# EAGLE design HATv1 (EAGLE 9.1.3)

## Sheet 1 of 4: Power Components
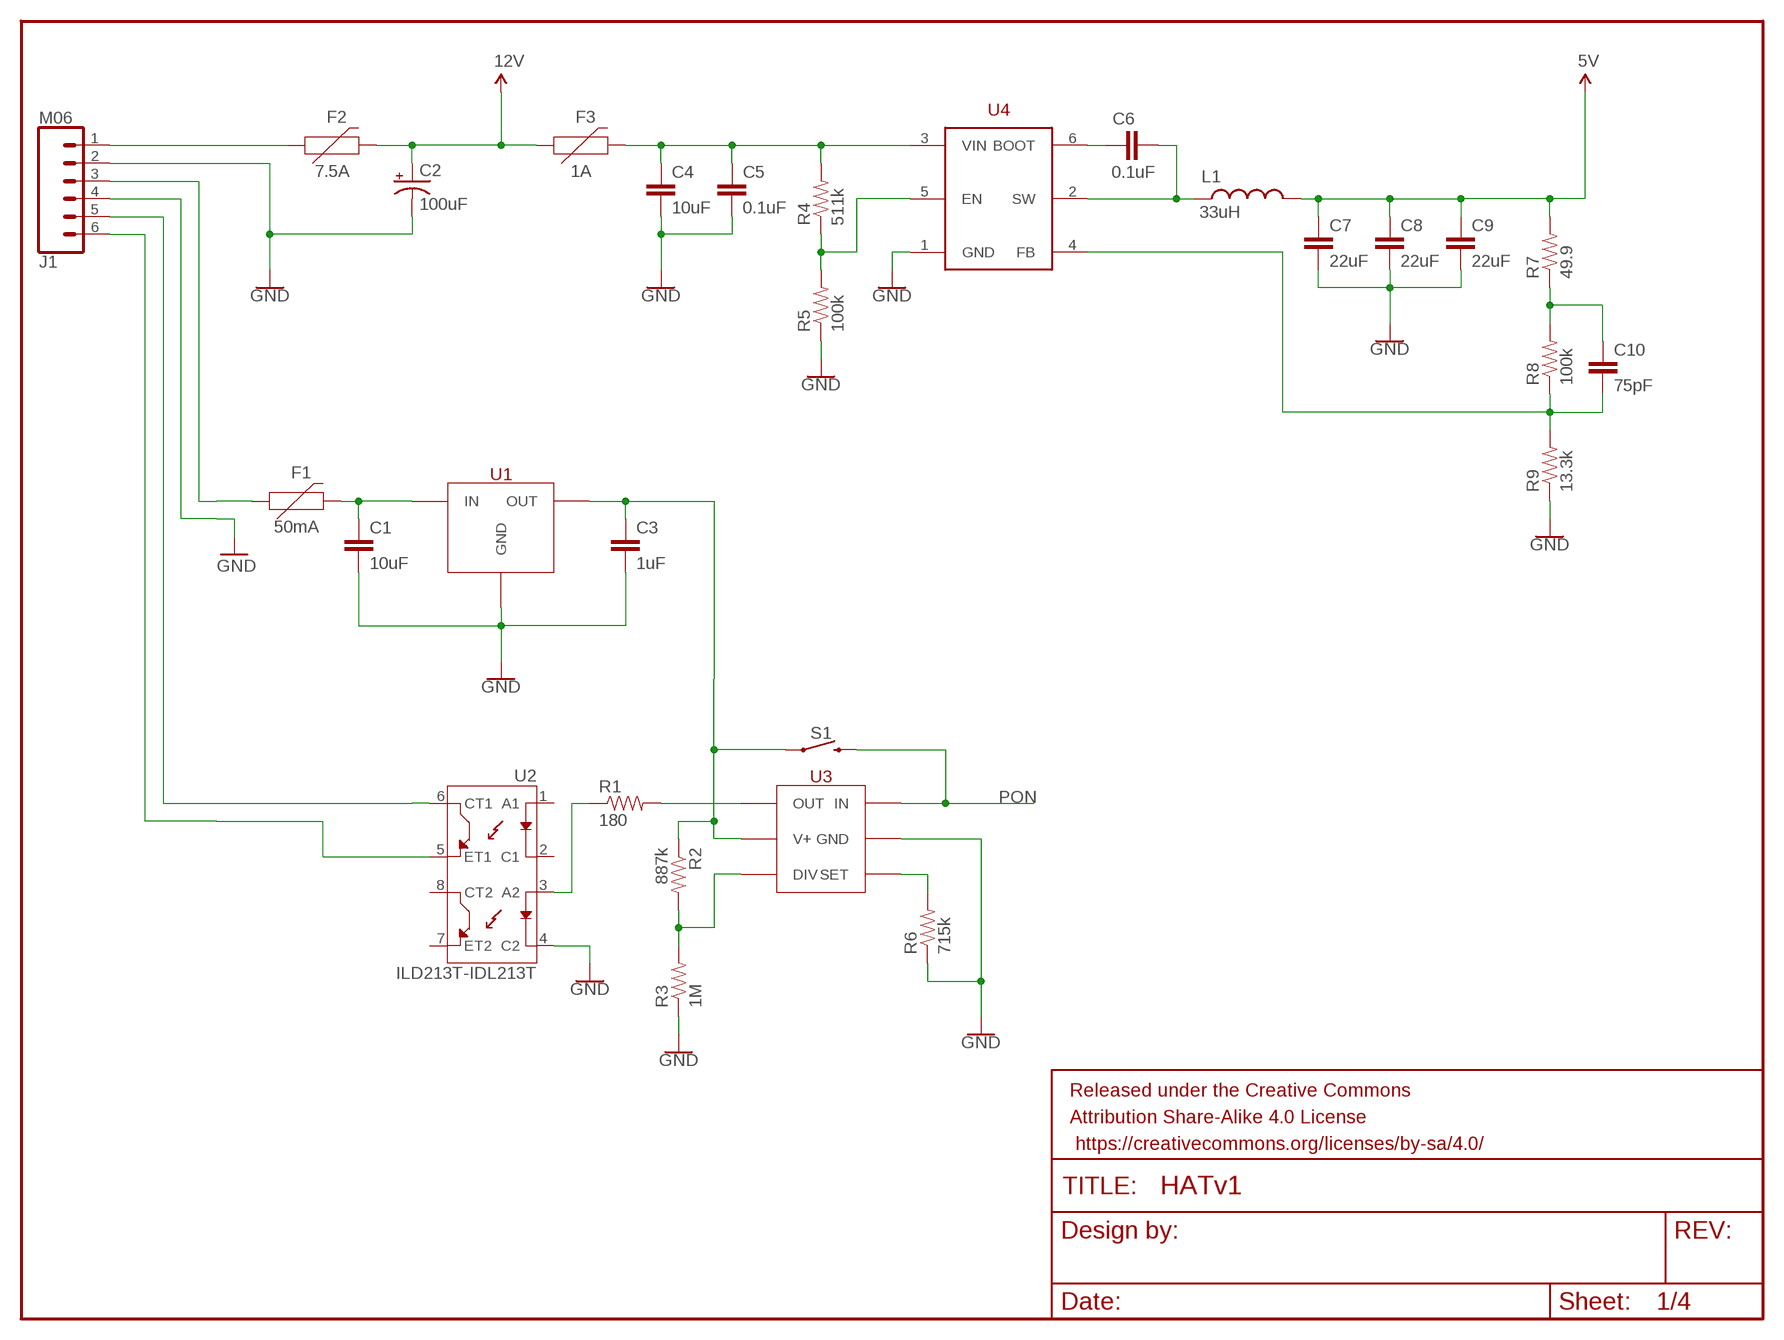
[diagram p0: schematic, sheet 1]

### Parts
C1  10uF  CAP0805  [0805]
C2  100uF  CAP_POLE  [PANASONIC_E]
C3  1uF  CAP0603-CAP  [0603-CAP]
C4  10uF  CAP0805  [0805]
C5  0.1uF  CAP0603-CAP  [0603-CAP]
C6  0.1uF  CAP0603-CAP  [0603-CAP]
C7  22uF  CAP1210  [1210]
C8  22uF  CAP1210  [1210]
C9  22uF  CAP1210  [1210]
C10  75pF  CAP0603-CAP  [0603-CAP]
F1  50mA  PPTC_PTH  [PTH]
F2  7.5A  PPTC_HALF-AMP  [1206]
F3  1A  PTC  [2010]
FRAME1  FRAME-LETTERNO_PACKAGE  [DUMMY]
J1  M06  [SCREWTERMINAL-3.5MM-6]
L1  33uH  INDUCTORSRP1265  [SRP1265A]
R1  180  RESISTOR0603-RES  [0603-RES]
R2  887k  RESISTOR0603-RES  [0603-RES]
R3  1M  RESISTOR0603-RES  [0603-RES]
R4  511k  RESISTOR0603-RES  [0603-RES]
R5  100k  RESISTOR0603-RES  [0603-RES]
R6  715k  RESISTOR0603-RES  [0603-RES]
R7  49.9  RESISTOR0603-RES  [0603-RES]
R8  100k  RESISTOR0603-RES  [0603-RES]
R9  13.3k  RESISTOR0603-RES  [0603-RES]
S1  MOMENTARY-SWITCH-SPST-SMD-12MM  [TACTILE_SWITCH_SMD_12MM]
U1  NCP715  [SC70]
U2  ILD213T-IDL213T  [SO08]
U3  LT6994  [SOT23-6]
U4  TPS54302  [SOT23-6]

### Nets
5V: C7.1 C8.1 C9.1 L1.P$2 R7.2 ; also sheet 2,3
12V: C2.+ F2.2 F3.1 ; also sheet 3
GND: C1.2 C2.- C3.2 C4.2 C5.2 C7.2 C8.2 C9.2 J1.2 J1.4 R3.1 R5.1 R6.1 R9.1 U1.2(GND) U2.4(C2) U3.2(GND) U4.1(GND) ; also sheet 2,3,4
N$1: R1.1 U2.3(A2)
N$4: C6.1 U4.6(BOOT)
N$5: C6.2 L1.P$1 U4.2(SW)
N$7: C10.1 R7.1 R8.2
N$8: C10.2 R8.1 R9.2 U4.4(FB)
N$9: R4.1 R5.2 U4.5(EN)
N$26: J1.6 U2.5(ET1)
N$27: J1.5 U2.6(CT1)
N$37: R1.2 U3.6(OUT)
N$38: R2.2 R3.2 U3.4(DIV)
N$39: R6.2 U3.3(SET)
N$40: C3.1 R2.1 S1.1 U1.5(OUT) U3.5(V+)
N$41: C1.1 F1.P$2 U1.4(IN)
N$42: F1.P$1 J1.3
N$43: C4.1 C5.1 F3.2 R4.2 U4.3(VIN)
N$44: F2.1 J1.1
PON: S1.3 U3.1(IN) ; also sheet 2
Unconnected: U2.1(A1) U2.2(C1) U2.7(ET2) U2.8(CT2)

## Sheet 2 of 4: Pi and Expansion
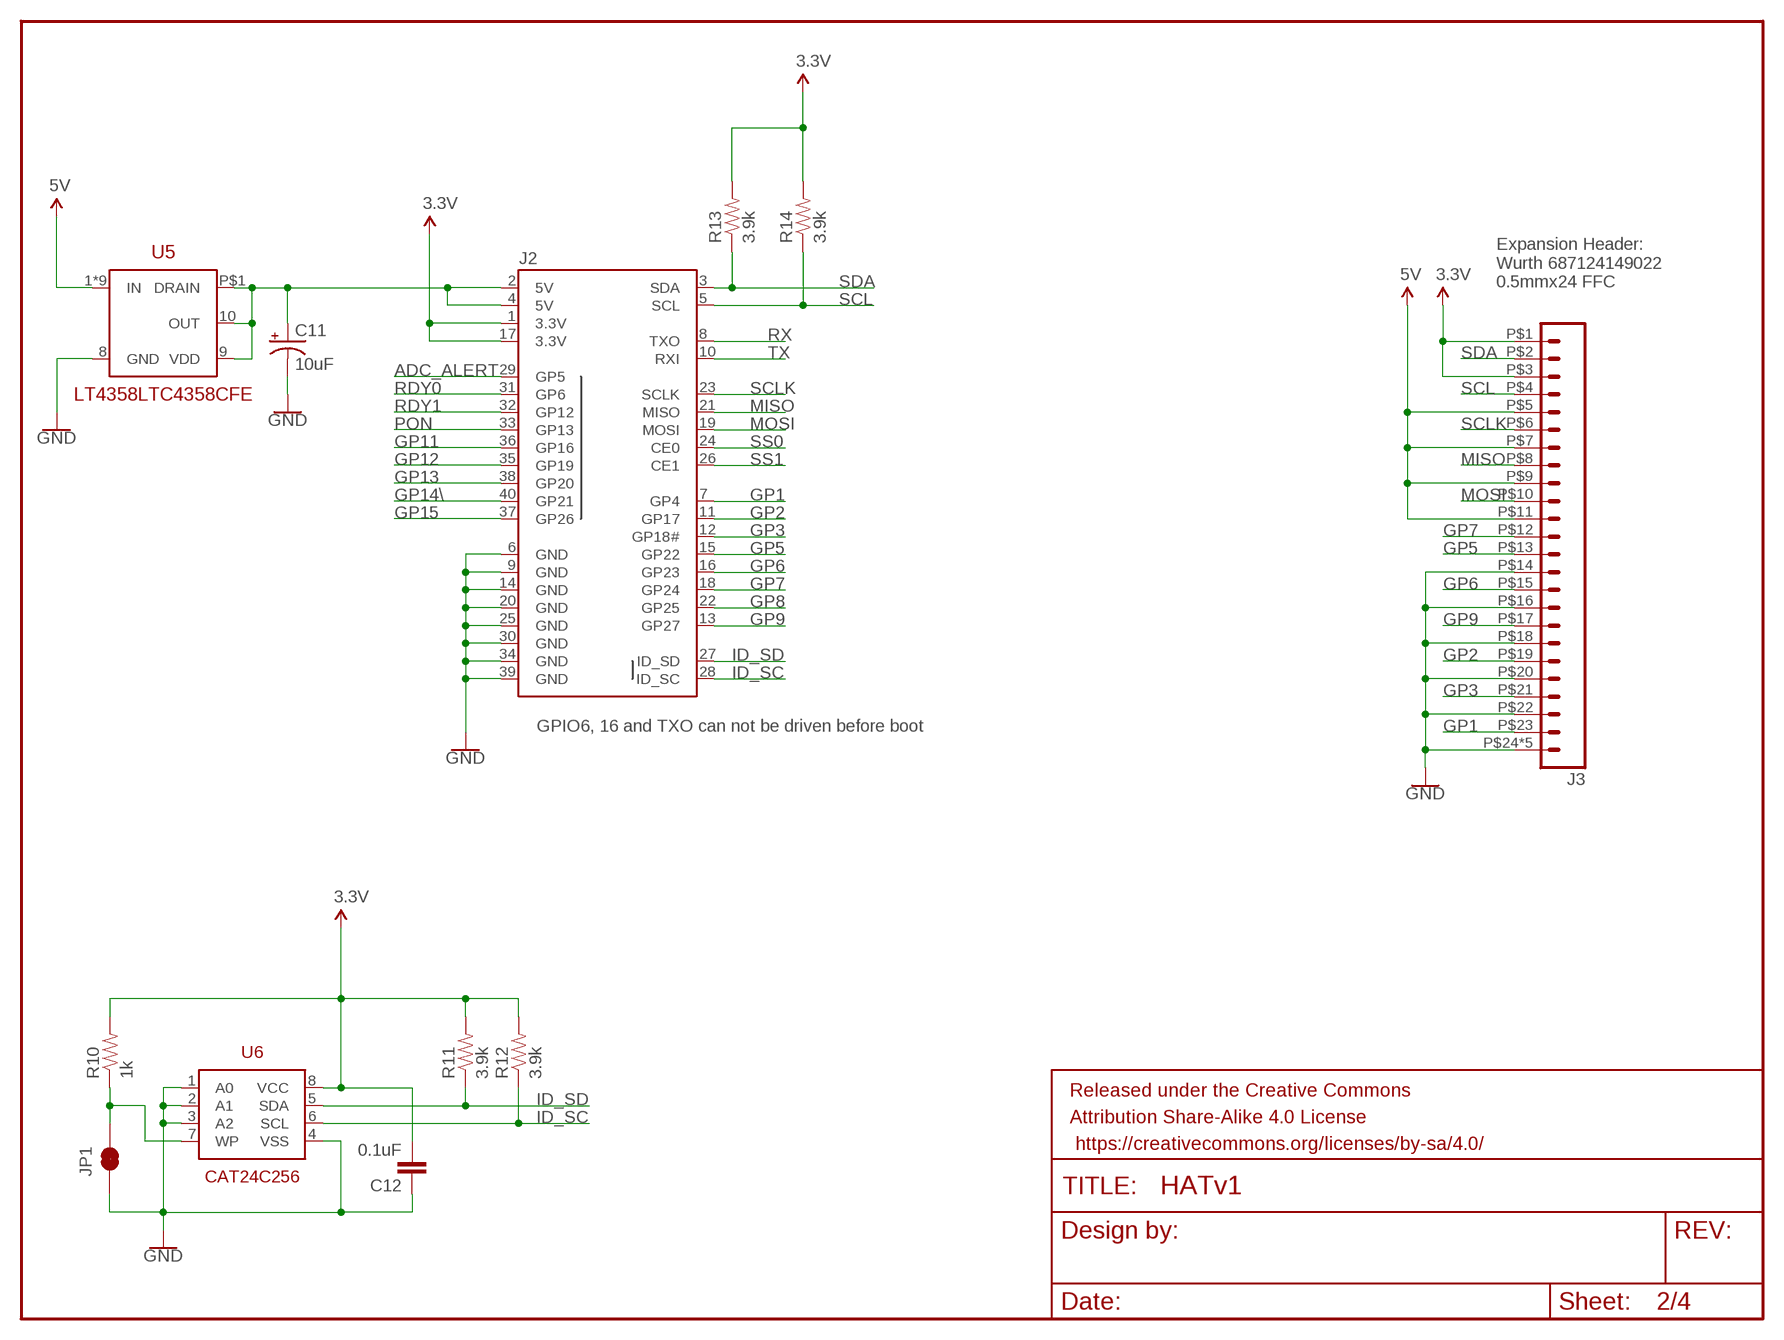
[diagram p1: schematic, sheet 2]

### Parts
C11  10uF  10UF-POLAR-EIA3216-16V-10%(TANT)  [EIA3216]
C12  0.1uF  CAP0603-CAP  [0603-CAP]
FRAME2  FRAME-LETTERNO_PACKAGE  [DUMMY]
J2  RASPBERRYPI-40-PIN-GPIO2X20PASSTHROUGH  [1X24SAMTEC]
J3  M24FFC  [FFC_24]
JP1  JUMPER-PAD-2-NC_BY_TRACE  [PAD-JUMPER-2-NC_BY_TRACE_YES_SILK]
R10  1k  RESISTOR0603-RES  [0603-RES]
R11  3.9k  RESISTOR0603-RES  [0603-RES]
R12  3.9k  RESISTOR0603-RES  [0603-RES]
R13  3.9k  RESISTOR0603-RES  [0603-RES]
R14  3.9k  RESISTOR0603-RES  [0603-RES]
U5  LT4358LTC4358CFE  [TSSOP-16]
U6  CAT24C256  [SO8]

### Nets
3.3V: C12.2 J2.1(3.3V) J2.17(3.3V) J3.P$1 J3.P$3 R10.2 R11.2 R12.2 R13.2 R14.2 U6.8(VCC) ; also sheet 3,4
5V: J3.P$5 J3.P$7 J3.P$9 J3.P$11 U5.1(IN) U5.2(IN) U5.3(IN) U5.4(IN) U5.12(IN) U5.13(IN) U5.14(IN) U5.15(IN) U5.16(IN) ; also sheet 1,3
ADC_ALERT: J2.29(GP5) ; also sheet 3
GND: C11.- C12.1 J2.6(GND) J2.9(GND) J2.14(GND) J2.20(GND) J2.25(GND) J2.30(GND) J2.34(GND) J2.39(GND) J3.P$14 J3.P$16 J3.P$18 J3.P$20 J3.P$22 J3.P$24 J3.P$25 J3.P$26 J3.P$27 J3.P$28 JP1.1 U5.8(GND) U6.1(A0) U6.2(A1) U6.3(A2) U6.4(VSS) ; also sheet 1,3,4
GP1: J2.7(GP4) J3.P$23
GP2: J2.11(GP17) J3.P$19
GP3: J2.12(GP18#) J3.P$21
GP5: J2.15(GP22) J3.P$13
GP6: J2.16(GP23) J3.P$15
GP7: J2.18(GP24) J3.P$12
GP8: J2.22(GP25)
GP9: J2.13(GP27) J3.P$17
GP11: J2.36(GP16)
GP12: J2.35(GP19)
GP13: J2.38(GP20)
GP14\: J2.40(GP21)
GP15: J2.37(GP26)
ID_SC: J2.28(ID_SC) R12.1 U6.6(SCL)
ID_SD: J2.27(ID_SD) R11.1 U6.5(SDA)
MISO: J2.21(MISO) J3.P$8 ; also sheet 4
MOSI: J2.19(MOSI) J3.P$10 ; also sheet 4
N$3: JP1.2 R10.1 U6.7(WP)
N$6: C11.+ J2.2(5V) J2.4(5V) U5.9(VDD) U5.10(OUT) U5.P$1(DRAIN)
PON: J2.33(GP13) ; also sheet 1
RDY0: J2.31(GP6) ; also sheet 4
RDY1: J2.32(GP12) ; also sheet 4
RX: J2.8(TXO) ; also sheet 4
SCL: J2.5(SCL) J3.P$4 R14.1 ; also sheet 3
SCLK: J2.23(SCLK) J3.P$6 ; also sheet 4
SDA: J2.3(SDA) J3.P$2 R13.1 ; also sheet 3
SS0: J2.24(CE0) ; also sheet 4
SS1: J2.26(CE1) ; also sheet 4
TX: J2.10(RXI) ; also sheet 4

### Notes on the sheet
- Expansion Header: 
  Wurth 687124149022 
  0.5mmx24 FFC
- GPIO6, 16 and TXO can not be driven before boot

## Sheet 3 of 4: Output Components
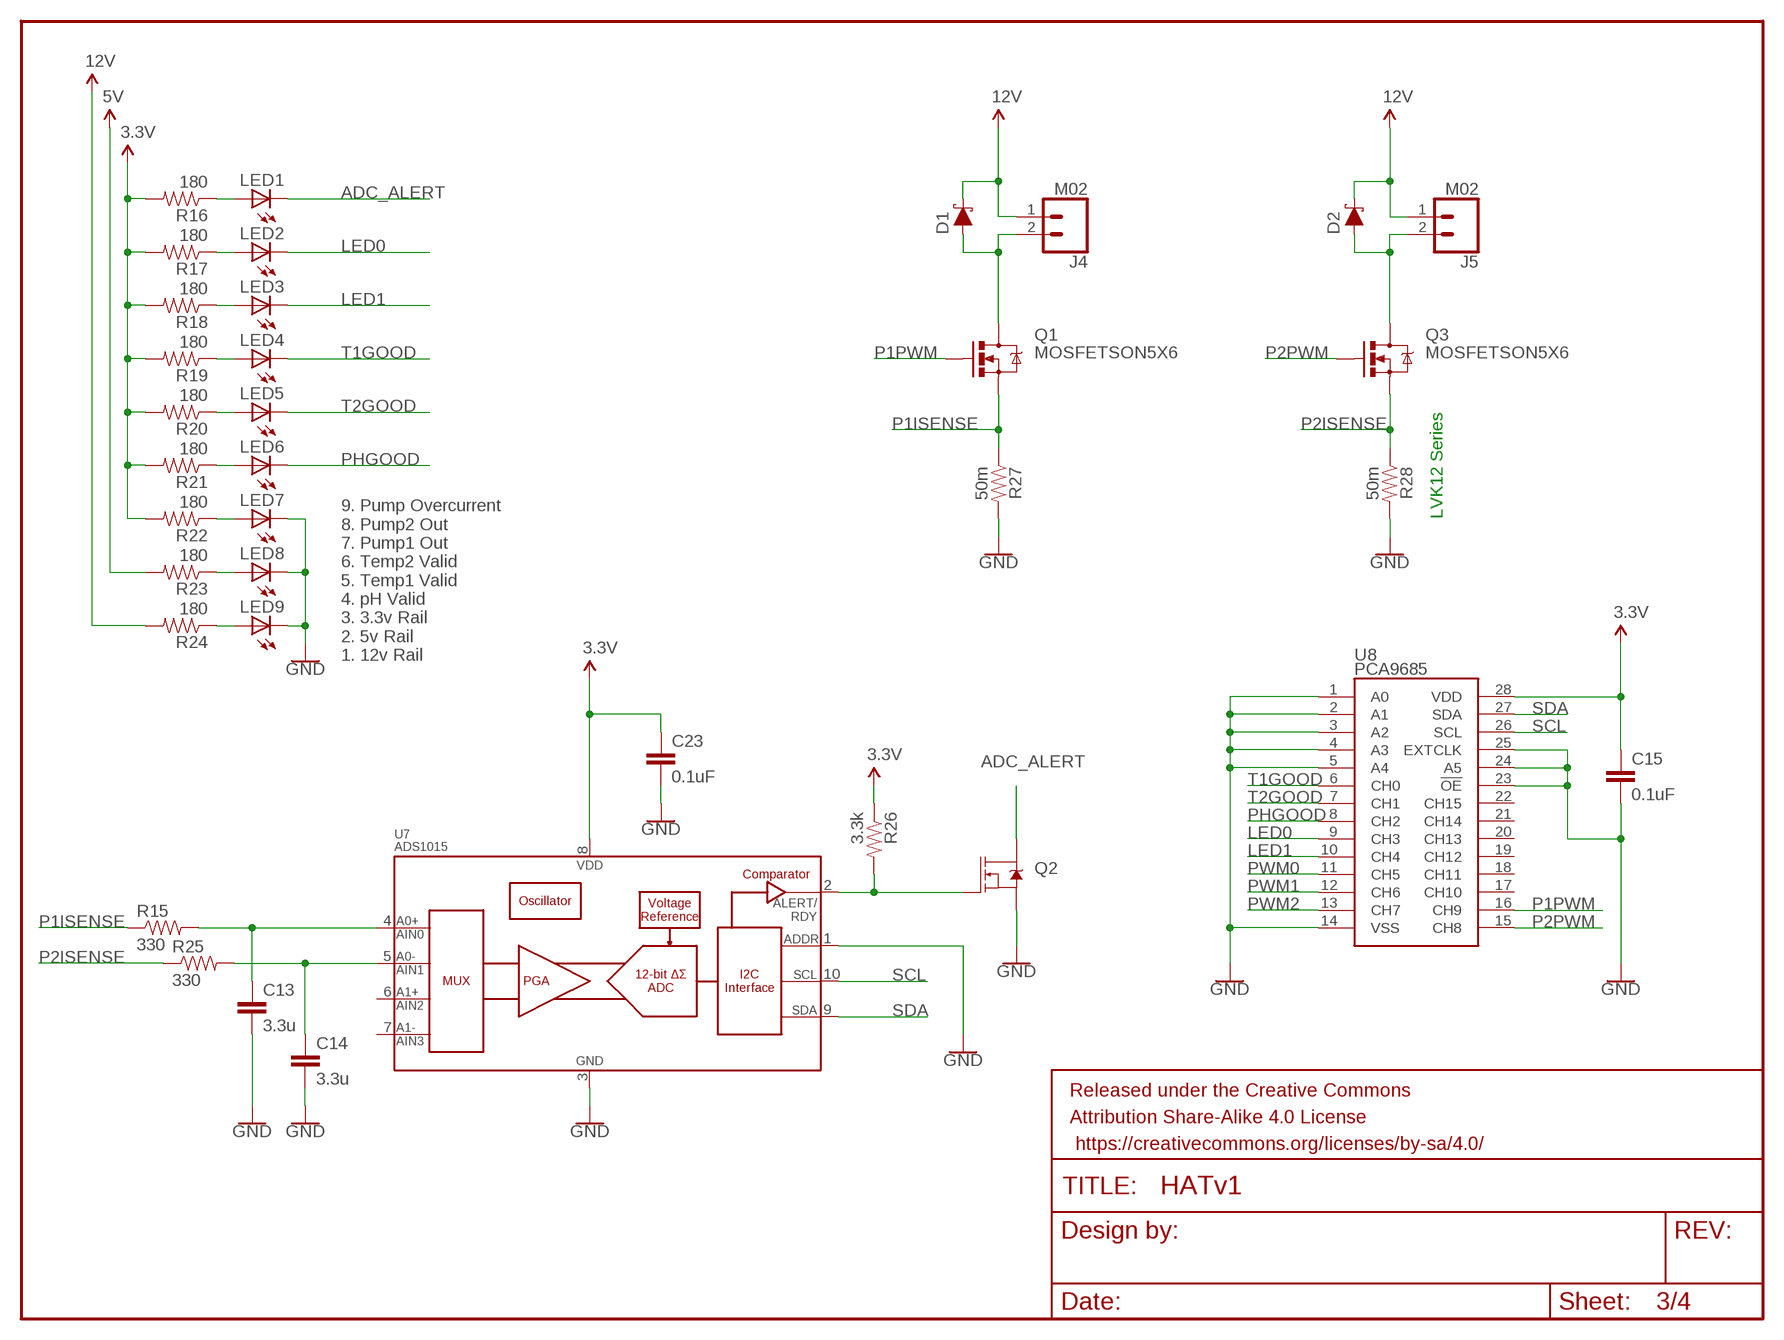
[diagram p2: schematic, sheet 3]

### Parts
C13  3.3u  2.2UF-0603-10V-20%  [0603]
C14  3.3u  2.2UF-0603-10V-20%  [0603]
C15  0.1uF  CAP0603-CAP  [0603-CAP]
C23  0.1uF  CAP0603-CAP  [0603-CAP]
D1  DIODE-SCHOTTKY-B340A  [SMA-DIODE]
D2  DIODE-SCHOTTKY-B340A  [SMA-DIODE]
FRAME3  FRAME-LETTERNO_PACKAGE  [DUMMY]
J4  M02  [SCREWTERMINAL-3.5MM-2]
J5  M02  [SCREWTERMINAL-3.5MM-2]
LED1  LEDCHIP-LED0603  [CHIP-LED0603]
LED2  LEDCHIP-LED0603  [CHIP-LED0603]
LED3  LEDCHIP-LED0603  [CHIP-LED0603]
LED4  LEDCHIP-LED0603  [CHIP-LED0603]
LED5  LEDCHIP-LED0603  [CHIP-LED0603]
LED6  LEDCHIP-LED0603  [CHIP-LED0603]
LED7  LEDCHIP-LED0603  [CHIP-LED0603]
LED8  LEDCHIP-LED0603  [CHIP-LED0603]
LED9  LEDCHIP-LED0603  [CHIP-LED0603]
Q1  MOSFETSON5X6  [SON5X6MM]
Q2  MOSFET-NCH-BSS138  [SOT23-3]
Q3  MOSFETSON5X6  [SON5X6MM]
R15  330  RESISTOR0603-RES  [0603-RES]
R16  180  RESISTOR0603-RES  [0603-RES]
R17  180  RESISTOR0603-RES  [0603-RES]
R18  180  RESISTOR0603-RES  [0603-RES]
R19  180  RESISTOR0603-RES  [0603-RES]
R20  180  RESISTOR0603-RES  [0603-RES]
R21  180  RESISTOR0603-RES  [0603-RES]
R22  180  RESISTOR0603-RES  [0603-RES]
R23  180  RESISTOR0603-RES  [0603-RES]
R24  180  RESISTOR0603-RES  [0603-RES]
R25  330  RESISTOR0603-RES  [0603-RES]
R26  3.3k  RESISTOR0603-RES  [0603-RES]
R27  50m  RESISTOR1206  [1206]
R28  50m  RESISTOR1206  [1206]
U7  ADS1015  [MSOP10]
U8  PCA9685  [TSSOP-28_4MM]

### Nets
3.3V: C15.1 C23.1 R16.2 R17.2 R18.2 R19.2 R20.2 R21.2 R22.2 R26.1 U7.8(VDD) U8.28(VDD) ; also sheet 2,4
5V: R23.2 ; also sheet 1,2
12V: D1.C D2.C J4.1 J5.1 R24.2 ; also sheet 1
ADC_ALERT: LED1.C Q2.3(D) ; also sheet 2
GND: C13.2 C14.2 C15.2 C23.2 LED7.C LED8.C LED9.C Q2.2(S) R27.2 R28.2 U7.1(ADDR) U7.3(VSS) U8.1(A0) U8.2(A1) U8.3(A2) U8.4(A3) U8.5(A4) U8.14(VSS) U8.23(!OE) U8.24(A5) U8.25(EXTCLK) ; also sheet 1,2,4
LED0: LED2.C U8.9(CH3)
LED1: LED3.C U8.10(CH4)
N$2: LED1.A R16.1
N$13: D1.A J4.2 Q1.P$5(D) Q1.P$6(D) Q1.P$7(D) Q1.P$8(D) Q1.P$9(D)
N$14: D2.A J5.2 Q3.P$5(D) Q3.P$6(D) Q3.P$7(D) Q3.P$8(D) Q3.P$9(D)
N$15: C13.1 R15.2 U7.4(AIN0)
N$16: Q2.1(G) R26.2 U7.2(ALERT/RDY)
N$17: LED2.A R17.1
N$18: LED3.A R18.1
N$19: LED4.A R19.1
N$20: LED5.A R20.1
N$21: LED6.A R21.1
N$22: LED7.A R22.1
N$23: LED8.A R23.1
N$24: LED9.A R24.1
N$25: C14.1 R25.2 U7.5(AIN1)
P1ISENSE: Q1.P$1(S) Q1.P$2(S) Q1.P$3(S) R15.1 R27.1
P1PWM: Q1.P$4(G) U8.16(CH9)
P2ISENSE: Q3.P$1(S) Q3.P$2(S) Q3.P$3(S) R25.1 R28.1
P2PWM: Q3.P$4(G) U8.15(CH8)
PHGOOD: LED6.C U8.8(CH2)
PWM0: U8.11(CH5)
PWM1: U8.12(CH6)
PWM2: U8.13(CH7)
SCL: U7.10(SCL) U8.26(SCL) ; also sheet 2
SDA: U7.9(SDA) U8.27(SDA) ; also sheet 2
T1GOOD: LED4.C U8.6(CH0)
T2GOOD: LED5.C U8.7(CH1)
Unconnected: U7.6(AIN2) U7.7(AIN3) U8.17(CH10) U8.18(CH11) U8.19(CH12) U8.20(CH13) U8.21(CH14) U8.22(CH15)

### Notes on the sheet
- LVK12 Series
- 9. Pump Overcurrent
  8. Pump2 Out
  7. Pump1 Out
  6. Temp2 Valid
  5. Temp1 Valid
  4. pH Valid
  3. 3.3v Rail
  2. 5v Rail
  1. 12v Rail

## Sheet 4 of 4: Sensor Components
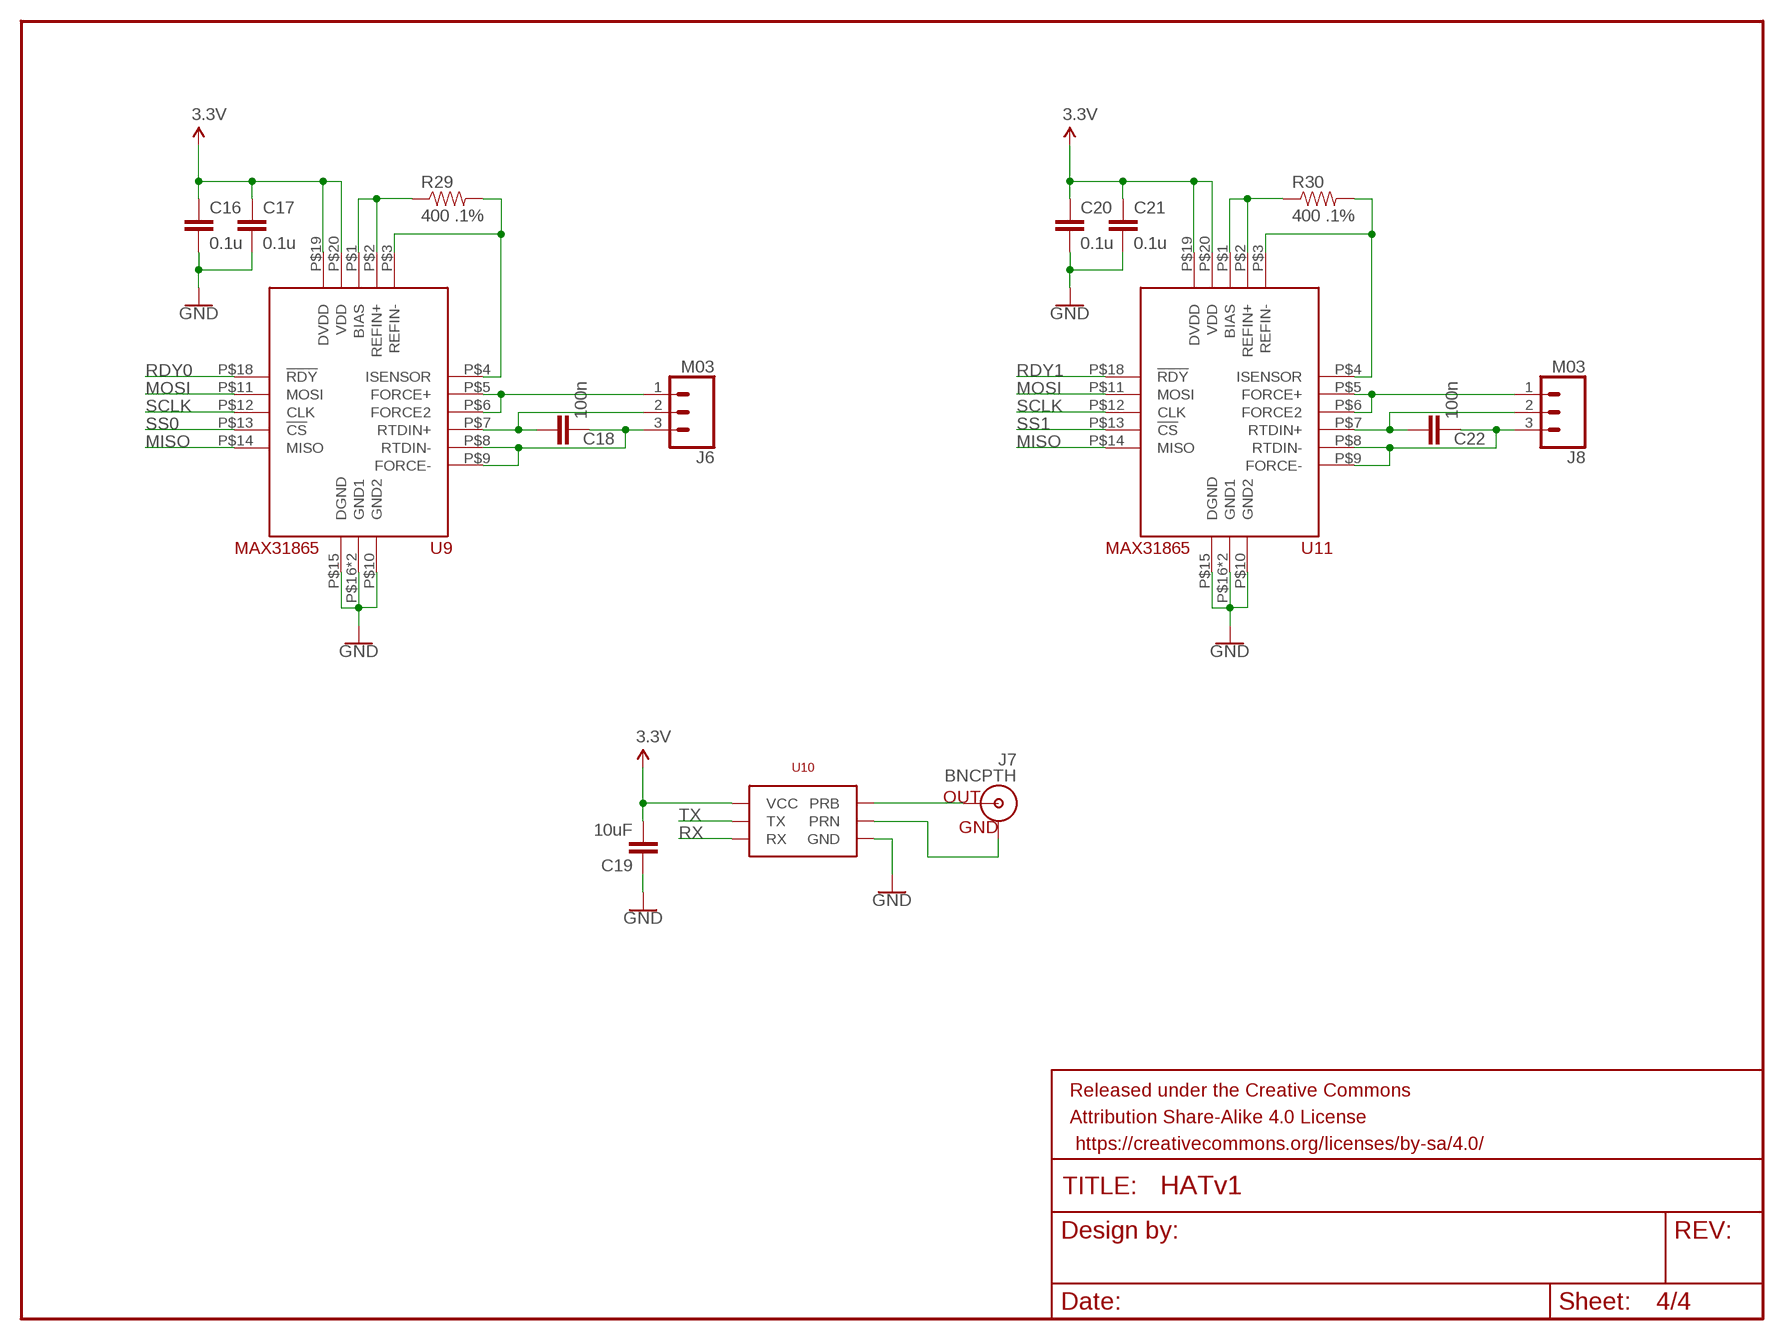
[diagram p3: schematic, sheet 4]

### Parts
C16  0.1u  CAP0603-CAP  [0603-CAP]
C17  0.1u  CAP0603-CAP  [0603-CAP]
C18  100n  CAP0603-CAP  [0603-CAP]
C19  10uF  10UF-1206-6.3V-20%  [1206]
C20  0.1u  CAP0603-CAP  [0603-CAP]
C21  0.1u  CAP0603-CAP  [0603-CAP]
C22  100n  CAP0603-CAP  [0603-CAP]
FRAME4  FRAME-LETTERNO_PACKAGE  [DUMMY]
J6  M03  [1X03]
J7  BNCPTH  [BNC]
J8  M03  [1X03]
R29  400 .1%  RESISTOR0603-RES  [0603-RES]
R30  400 .1%  RESISTOR0603-RES  [0603-RES]
U9  MAX31865  [TQFN20]
U10  EZOPH  [EZOPH]
U11  MAX31865  [TQFN20]

### Nets
3.3V: C16.1 C17.1 C19.2 C20.1 C21.1 U9.P$19(DVDD) U9.P$20(VDD) U10.VCC U11.P$19(DVDD) U11.P$20(VDD) ; also sheet 2,3
GND: C16.2 C17.2 C19.1 C20.2 C21.2 U9.P$10(GND2) U9.P$15(DGND) U9.P$16(GND1) U9.P$21(GND1) U10.GND U11.P$10(GND2) U11.P$15(DGND) U11.P$16(GND1) U11.P$21(GND1) ; also sheet 1,2,3
MISO: U9.P$14(MISO) U11.P$14(MISO) ; also sheet 2
MOE2: J6.1 U9.P$5(FORCE+) U9.P$6(FORCE2)
MOE3: J8.1 U11.P$5(FORCE+) U11.P$6(FORCE2)
MOSI: U9.P$11(MOSI) U11.P$11(MOSI) ; also sheet 2
N$11: J7.S(OUT) U10.PRB
N$12: J7.GND U10.PGND(PRN)
N$29: R29.1 U9.P$1(BIAS) U9.P$2(REFIN+)
N$30: R29.2 U9.P$3(REFIN-) U9.P$4(ISENSOR)
N$31: C18.2 J6.3 U9.P$8(RTDIN-) U9.P$9(FORCE-)
N$32: C18.1 J6.2 U9.P$7(RTDIN+)
N$33: R30.1 U11.P$1(BIAS) U11.P$2(REFIN+)
N$34: R30.2 U11.P$3(REFIN-) U11.P$4(ISENSOR)
N$35: C22.2 J8.3 U11.P$8(RTDIN-) U11.P$9(FORCE-)
N$36: C22.1 J8.2 U11.P$7(RTDIN+)
RDY0: U9.P$18(!RDY) ; also sheet 2
RDY1: U11.P$18(!RDY) ; also sheet 2
RX: U10.RX ; also sheet 2
SCLK: U9.P$12(CLK) U11.P$12(CLK) ; also sheet 2
SS0: U9.P$13(!CS) ; also sheet 2
SS1: U11.P$13(!CS) ; also sheet 2
TX: U10.TX ; also sheet 2

## Library data of the parts
C1 C3-C10 C12 C15-C18 C20-C23 = SparkFun-Passives:CAP: Capacitor Standard 0603 ceramic capacitor, and 0.1" leaded capacitor.
C2 = SparkFun-Passives:CAP_POL: Capacitor Polarized These are standard SMD and PTH capacitors. Normally 10uF, 47uF, and 100uF in electrolytic and tantalum varieties. Always verify the external diameter of the through hole cap, it varies with capacity, voltage, and manufacturer. The EIA devices should be standard.
C11 = SparkFun-Capacitors:10UF-POLAR: 10.0µF polarized capacitors A capacitor is a passive two-terminal electrical component used to store electrical energy temporarily in an electric field.; PROD_ID: CAP-00811
C13 C14 = SparkFun-Capacitors:2.2UF: 2.2µF ceramic capacitors A capacitor is a passive two-terminal electrical component used to store electrical energy temporarily in an electric field.; PROD_ID: CAP-07888; VALUE: 2.2uF
C19 = SparkFun-Capacitors:10UF: 10.0µF ceramic capacitors A capacitor is a passive two-terminal electrical component used to store electrical energy temporarily in an electric field.; PROD_ID: CAP-10057
D1 D2 = SparkFun-DiscreteSemi:DIODE-SCHOTTKY: Schottky diode A Schottky diode is a semiconductor diode which has a low forward voltage drop and a very fast switching action.; PROD_ID: DIO-09886; VALUE: 3A/40V/500mV
F1 = SparkFun-Fuses:PPTC: Resettable Fuse PPTC Resettable Fuse. Really a sort of resistor with a polymeric positive temperature coefficient whose resistance increases dramatically with an increase in temperature. When heated by the power passing through the resistance rises causing the current to be limited, protecting the circuit. This is achieved by the transition of the polymer from a crystalline to an amorphous state where the conductive carbon separates breaking the conductive pathways found in the cool crystalline structure. When a PPTC cools back down it resumes conducting letting the circuit turn back on. SparkFun Products: SparkFun RedBoard - Programmed with Arduino <https://www.sparkfun.com/products/12757> Pro Micro - 5V/16MHz <https://www.sparkfun.com/products/12640> Arduino Pro 328 - 5V/16MHz <https://www.sparkfun.com/products/10915> MP3 Trigger <https://www.sparkfun.com/products/13720>; PROD_ID: RES-08490; VALUE: 72V/0.25A
F2 = SparkFun-Fuses:PPTC: Resettable Fuse PPTC Resettable Fuse. Really a sort of resistor with a polymeric positive temperature coefficient whose resistance increases dramatically with an increase in temperature. When heated by the power passing through the resistance rises causing the current to be limited, protecting the circuit. This is achieved by the transition of the polymer from a crystalline to an amorphous state where the conductive carbon separates breaking the conductive pathways found in the cool crystalline structure. When a PPTC cools back down it resumes conducting letting the circuit turn back on. SparkFun Products: SparkFun RedBoard - Programmed with Arduino <https://www.sparkfun.com/products/12757> Pro Micro - 5V/16MHz <https://www.sparkfun.com/products/12640> Arduino Pro 328 - 5V/16MHz <https://www.sparkfun.com/products/10915> MP3 Trigger <https://www.sparkfun.com/products/13720>; PROD_ID: RES-08585; VALUE: 6V/0.5A
F3 = BrewPi Custom:PTC
FRAME1 FRAME3 = SparkFun-Aesthetics:FRAME-LETTER: Schematic Frame Standard 8.5x11 US Letter frame; DESIGNER: Nobody; VERSION: v01
FRAME2 FRAME4 = SparkFun-Aesthetics:FRAME-LETTER: Schematic Frame - Letter Standard 8.5x11 US Letter frame; DESIGNER: Nobody; VERSION: v01
J1 = BrewPi Custom:M06
J2 = BrewPi Custom:RASPBERRYPI-40-PIN-GPIO: Second Generation Raspberry Pi GPIO Header 2x20 pin connector, as found on B, B+, A+ models.
J3 = BrewPi Custom:M24: 1x24 .1" header
J4 J5 = BrewPi Custom:M02
J6 J8 = BrewPi Custom:M03
J7 = SparkFun-Connectors:BNC: BNC Right Angle Connector Mouser Part# 5227161 SparkFun Products: BNC Connector - Right Angle <https://www.sparkfun.com/products/10550>; PROD_ID: LPA-12729; SF_ID: PRT-10550
JP1 = SparkFun-Passives:JUMPER-PAD-2-NC_BY_TRACE
L1 = 5v Buck:INDUCTOR
LED1-LED9 = adafruit:LED: LED OSRAM: - CHIPLED LG R971, LG N971, LY N971, LG Q971, LY Q971, LO R971, LY R971 LH N974, LH R974 LS Q976, LO Q976, LY Q976 LO Q996 - Hyper CHIPLED LW Q18S LB Q993, LB Q99A, LB R99A - SideLED LS A670, LO A670, LY A670, LG A670, LP A670 LB A673, LV A673, LT A673, LW A673 LH A674 LY A675 LS A676, LA A676, LO A676, LY A676, LW A676 LS A679, LY A679, LG A679 - Hyper Micro SIDELED® LS Y876, LA Y876, LO Y876, LY Y876 LT Y87S - SmartLED LW L88C, LW L88S LB L89C, LB L89S, LG L890 LS L89K, LO L89K, LY L89K LS L896, LA L896, LO L896, LY L896 - TOPLED LS T670, LO T670, LY T670, LG T670, LP T670 LSG T670, LSP T670, LSY T670, LOP T670, LYG T670 LG T671, LOG T671, LSG T671 LB T673, LV T673, LT T673, LW T673 LH T674 LS T676, LA T676, LO T676, LY T676, LB T676, LH T676, LSB T676, LW T676 LB T67C, LV T67C, LT T67C, LS T67K, LO T67K, LY T67K, LW E67C LS E67B, LA E67B, LO E67B, LY E67B, LB E67C, LV E67C, LT E67C LW T67C LS T679, LY T679, LG T679 LS T770, LO T770, LY T770, LG T770, LP T770 LB T773, LV T773, LT T773, LW T773 LH T774 LS E675, LA E675, LY E675, LS T675 LS T776, LA T776, LO T776, LY T776, LB T776 LHGB T686 LT T68C, LB T68C - Hyper Mini TOPLED® LB M676 - Mini TOPLED Santana® LG M470 LS M47K, LO M47K, LY M47K Source: http://www.osram.convergy.de/
Q1 Q3 = 18v BuckBoost:MOSFET
Q2 = SparkFun-DiscreteSemi:MOSFET-NCH: N-channel MOSFETs Voltage controlled devices that allow control of high current outputs. SparkFun Products: SparkFun OpenScale <https://www.sparkfun.com/products/13261> SparkFun Digital Sandbox <https://www.sparkfun.com/products/12651> SparkFun Monster Moto Shield <https://www.sparkfun.com/products/10182> SparkFun MOSFET Power Controller <https://www.sparkfun.com/products/11214>; PROD_ID: TRANS-00830; VALUE: 220mA/50V/3.5Ω
R1-R26 R29 R30 = SparkFun-Passives:RESISTOR: Resistor Basic schematic elements and footprints for 0603, 1206, and PTH resistors.
R27 R28 = SparkFun-Resistors:RESISTOR: Generic Resistor Package
S1 = SparkFun-Switches:MOMENTARY-SWITCH-SPST: Momentary Switch (Pushbutton) - SPST Normally-open (NO) SPST momentary switches (buttons, pushbuttons). Variants PTH-12MM - 12mm square, through-hole Momentary Pushbutton Switch - 12mm Square <https://www.sparkfun.com/products/9190> (COM-09190) PTH-6.0MM, PTH-6.0MM-KIT - 6.0mm square, through-hole Mini Pushbutton Switch <https://www.sparkfun.com/products/97> (COM-00097) KIT package intended for soldering kit's - only one side of pads' copper is exposed. PTH-RIGHT-ANGLE-KIT - Right-angle, through-hole Right Angle Tactile Button <https://www.sparkfun.com/products/10791> - Used on SparkFun BigTime Watch Kit <https://www.sparkfun.com/products/11734> SMD-12MM - 12mm square, surface-mount Tactile Button - SMD (12mm) <https://www.sparkfun.com/products/12993> (COM-12993) Used on SparkFun PicoBoard <https://www.sparkfun.com/products/11888> SMD-4.5MM - 4.5mm Square Trackball Switch Used on SparkFun Blackberry Trackballer Breakout <https://www.sparkfun.com/products/13169> SMD-4.6MMX2.8MM - 4.60mm x 2.80mm, surface mount Used on SparkFun SAMD21 Mini Breakout <https://www.sparkfun.com/products/13664> SMD-5.2MM, SMD-5.2-REDUNDANT - 5.2mm square, surface-mount Mini Pushbutton Switch - SMD <https://www.sparkfun.com/products/8720> (COM-08720) Used on Arduino Pro Mini <https://www.sparkfun.com/products/11114> REDUNDANT package connects both switch circuits together SMD-6.0X3.5MM - 6.0 x 3.5mm, surface mount Momentary Reset Switch SMD <https://www.sparkfun.com/products/8229> (COM-08229) SMD-6.2MM-TALL - 6.2mm square, surface mount Tactile Button - SMD (6mm) <https://www.sparkfun.com/products/12992> Used on SparkFun Digital Sandbox <https://www.sparkfun.com/products/12651> SMD-RIGHT-ANGLE - Right-angle, surface mount Used on SparkFun Block for Intel® Edison - Arduino <https://www.sparkfun.com/products/13036>; PROD_ID: SWCH-11967; SF_SKU: COM-12993
U1 = BrewPi Custom:NCP715
U2 = SparkFun-DiscreteSemi:ILD213T: Dual Channel Phototransistor Optocoupler Dual Channel 70 V 4000 Vrms Phototransistor Optocoupler in a standard SOIC-8 package. Used to couple signals between electrically isolated circuits. Datasheet <https://www.sparkfun.com/datasheets/Components/SMD/ild205t.pdf> SparkFun Products: SparkFun Opto-Isolator Breakout <https://www.sparkfun.com/products/9118>; PROD_ID: IC-09076
U3 = BrewPi Custom:LT6994
U4 = 5v Buck:TPS54302
U5 = BrewPi Custom:LT4358
U6 = Special Components:CAT24C256
U7 = SparkFun-IC-Conversion:ADS1015: ADS1015 12-BIT ADC 12-Bit Del-Sig ADC Four single-ended inputs or two differential inputs Internal PGA I2C interface 2.0-5.5V SparkFun Products SparkFun Block for Intel Edison - ADC <https://www.sparkfun.com/products/13770> (DEV-13770); PROD_ID: IC-12270
U8 = SparkFun-DigitalIC:PCA9685: 16-channel 12-bit PWM I2C interface Internal Oscillator 40Hz to 1kHz Can be totem pole or open collector 2.3V to 5.5V; PROD_ID: IC-12240
U9 U11 = BrewPi Custom:MAX31865
U10 = BrewPi Custom:EZOPH

## Board
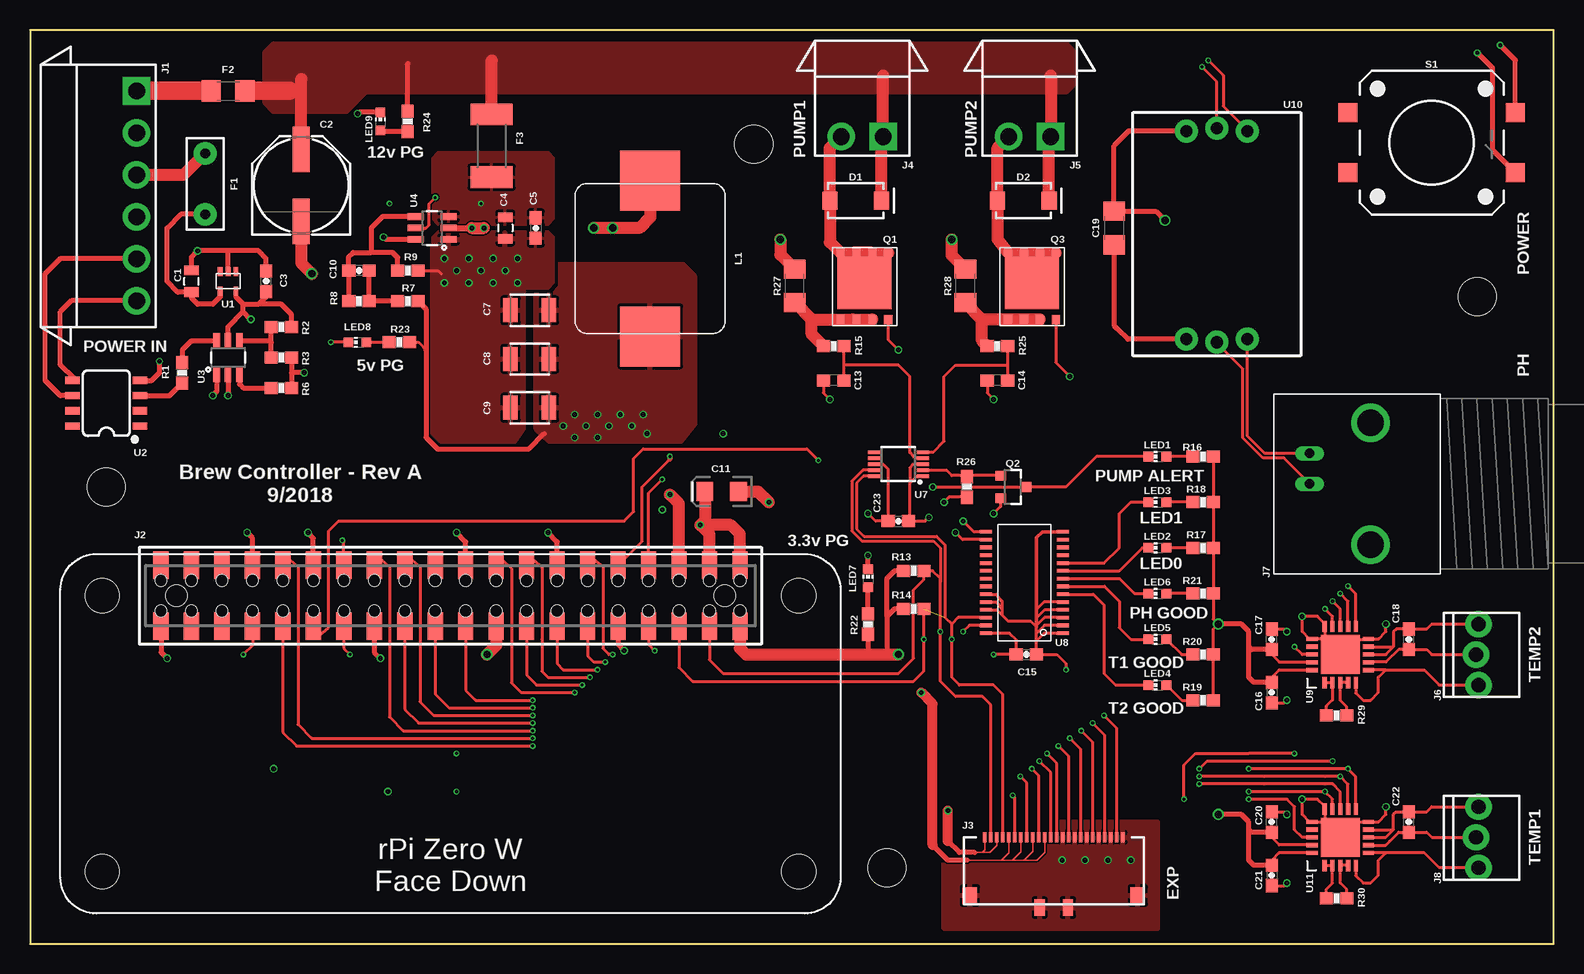
[diagram p4: board, top side]
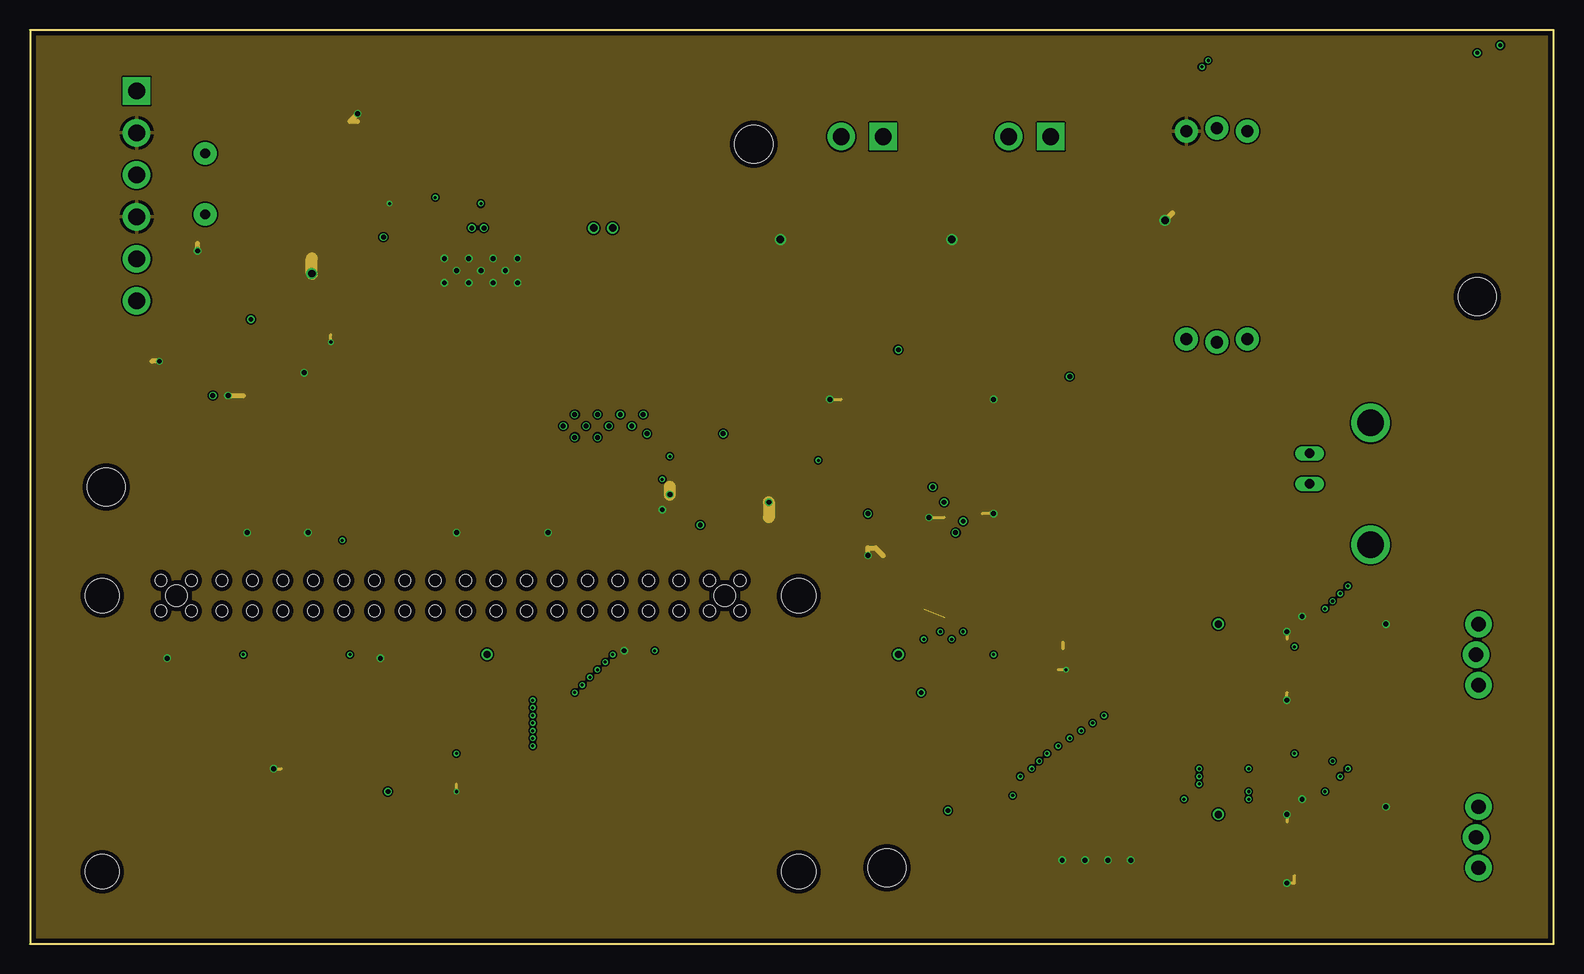
[diagram p5: board, inner layer Route2]
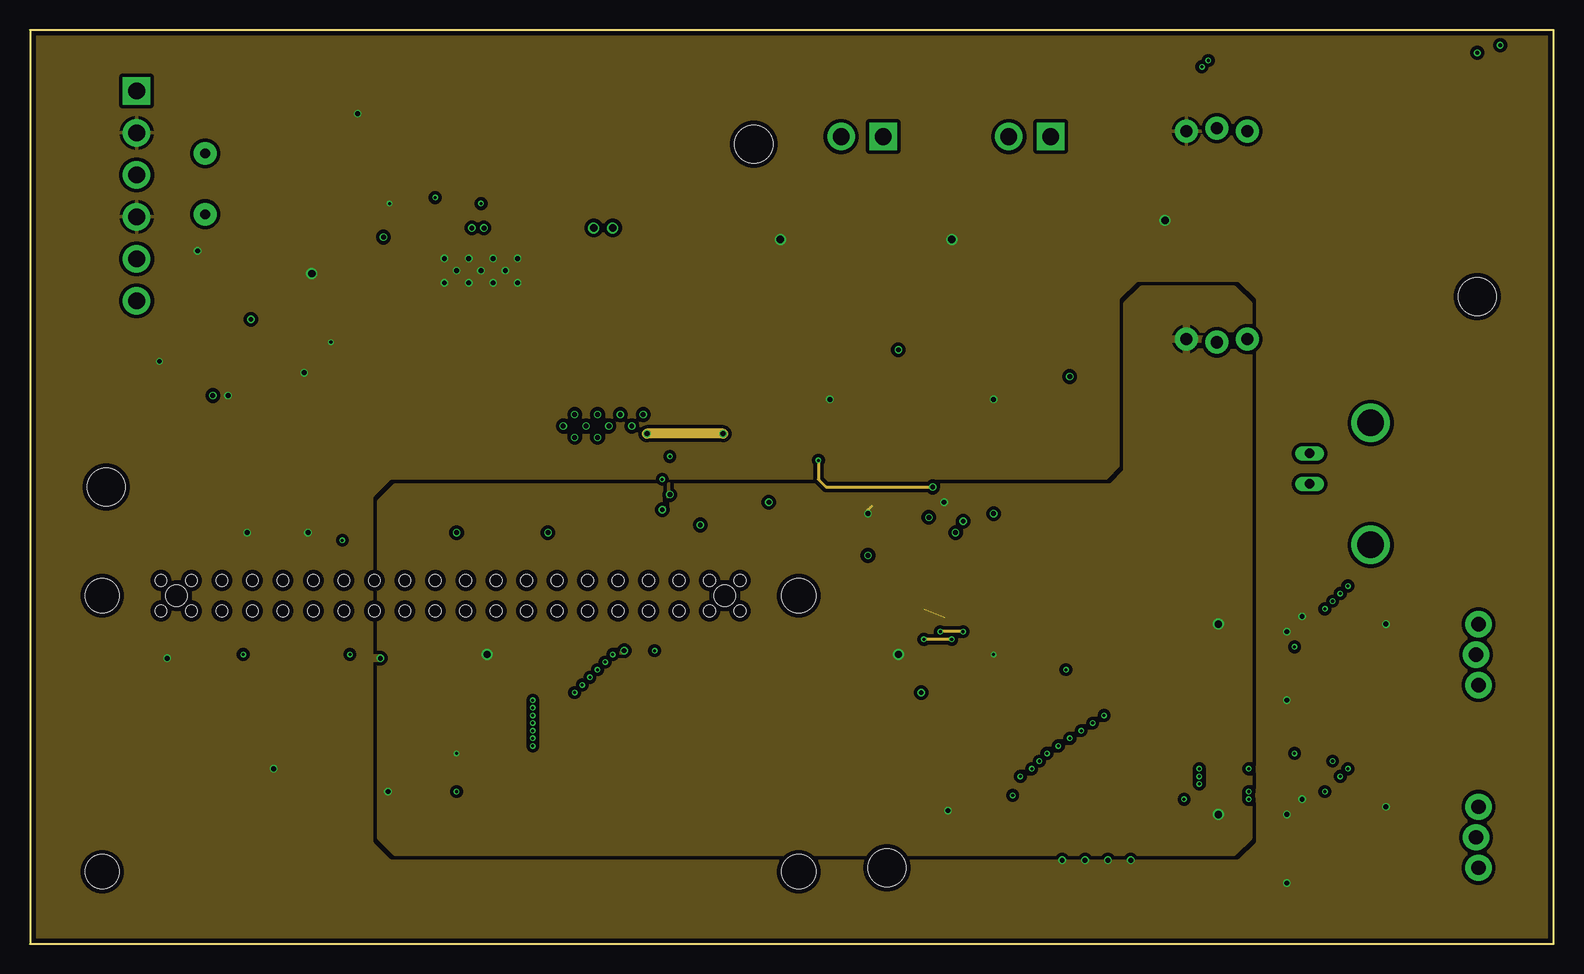
[diagram p6: board, inner layer Route15]
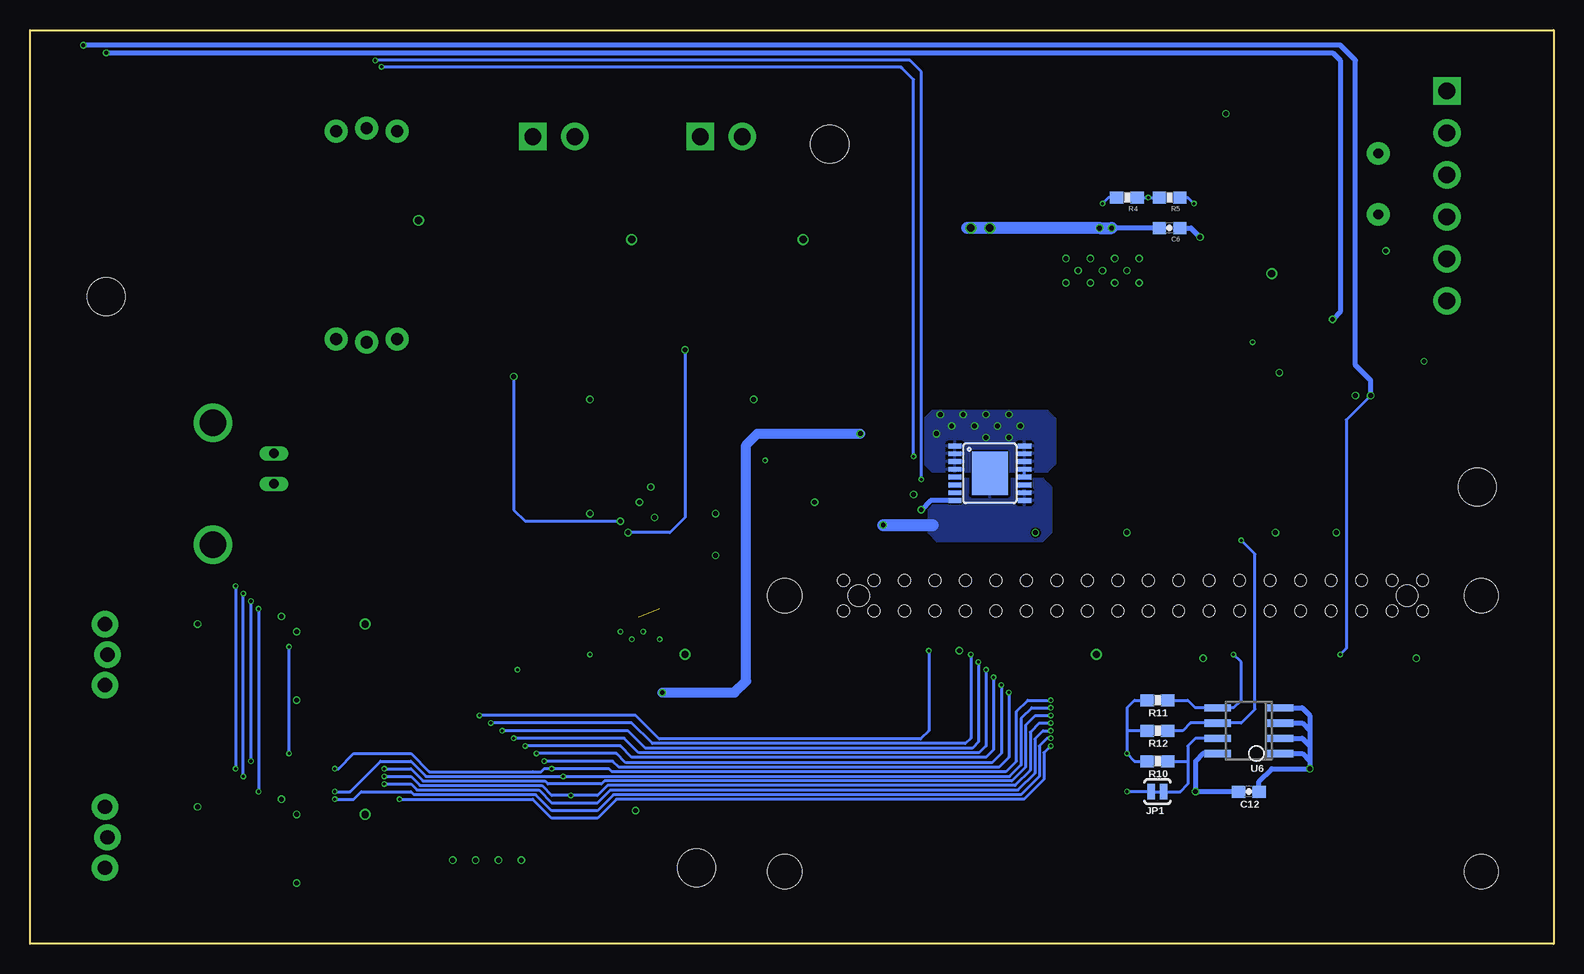
[diagram p7: board, bottom side, seen from below]

Size 127 x 76.2 mm. Coordinates in mm from the lower left corner, seen from the top.
Outline: 127,0 127,76.2 0,76.2 0,0 127,0
Copper layers (1+2*15+16): Top 0.035559375mm / dielectric 0.17018125mm / Route2 0.01778125mm / dielectric 47mil / Route15 0.01778125mm / dielectric 0.17018125mm / Bottom 0.035559375mm
Design rules "oshpark-4layer": minimum track width 5mil, minimum drill 10mil, track to track 5mil, track to pad 5mil, pad to pad 5mil, via to via 5mil, smd to smd 5mil, copper to edge 15mil, drill to drill 10mil, minimum pad ring 7mil, minimum via ring 4mil, stop-mask expansion 2.5mil, vias tented up to drill 0mil, thermal gap 10mil
Holes 2.84 mm at 6.02,6.02 6.02,29.03 64.08,29.03 64.08,6.02
Holes 3.17 mm at 71.44,6.35 6.35,38.1 120.65,53.98 60.33,66.67
tKeepout: area 3.2,34.9 to 9.5,41.3; area 68.3,3.2 to 74.6,9.5; area 117.5,50.8 to 123.8,57.1; area 57.2,63.5 to 63.5,69.8

### Footprints (pad centres in the part's own frame; a part is rotated, then mirrored left to right if it is on the bottom)
0805 = smd 0.8 x 1.2: 1 -0.9,0; 2 0.9,0
PANASONIC_E = smd 3.8 x 1.4: + 3,0; - -3,0
0603-CAP = smd 1.1 x 1: 1 -0.85,0; 2 0.85,0
1210 = smd 1.2 x 2: 1 -1.6,0; 2 1.6,0
EIA3216 = smd 1.4 x 1.6: + 1.4,0; - -1.4,0
0603 = smd 1.1 x 1: 1 -0.85,0; 2 0.85,0
1206 = smd 1.6 x 1.8: 1 -1.4,0; 2 1.4,0
SMA-DIODE = smd 1.27 x 1.47: A -2.15,0; C 2.15,0
PTH = drill 0.8 pad 1.88: P$1 -2.54,0; P$2 2.54,0
2010 = smd 1.8 x 3.513: 1 -2.616,0; 2 2.616,0
SCREWTERMINAL-3.5MM-6 = drill 1.4 pad 2.3 square: 1 0,0 | drill 1.4 pad 2.3: 2 3.5,0; 3 7,0; 4 10.5,0; 5 14,0; 6 17.5,0
1X24SAMTEC = smd 1.27 x 2.286: 1 41.91,-2.527; 2 41.91,2.527; 3 39.37,-2.527; 4 39.37,2.527; 5 36.83,-2.527; 6 36.83,2.527; 7 34.29,-2.527; 8 34.29,2.527; 9 31.75,-2.527; 10 31.75,2.527; 11 29.21,-2.527; 12 29.21,2.527; 13 26.67,-2.527; 14 26.67,2.527; 15 24.13,-2.527; 16 24.13,2.527; 17 21.59,-2.527; 18 21.59,2.527; 19 19.05,-2.527; 20 19.05,2.527; 21 16.51,-2.527; 22 16.51,2.527; 23 13.97,-2.527; 24 13.97,2.527; 25 11.43,-2.527; 26 11.43,2.527; 27 8.89,-2.527; 28 8.89,2.527; 29 6.35,-2.527; 30 6.35,2.527; 31 3.81,-2.527; 32 3.81,2.527; 33 1.27,-2.527; 34 1.27,2.527; 35 -1.27,-2.527; 36 -1.27,2.527; 37 -3.81,-2.553; 38 -3.81,2.527; 39 -6.35,-2.553; 40 -6.35,2.527 | hole 1.778: -5.08,0; 40.64,0 | hole 0.965: -1.27,1.27; -1.27,-1.27; 1.27,1.27; 3.81,1.27; 6.35,1.27; 8.89,1.27; 11.43,1.27; 13.97,1.27; 16.51,1.27; 19.05,1.27; 21.59,1.27; 24.13,1.27; 26.67,1.27; 29.21,1.27; 31.75,1.27; 34.29,1.27; 36.83,1.27; 39.37,1.27; 41.91,1.27; 41.91,-1.27; 39.37,-1.27; 36.83,-1.27; 34.29,-1.27; 31.75,-1.27; 29.21,-1.27; 26.67,-1.27; 24.13,-1.27; 21.59,-1.27; 19.05,-1.27; 16.51,-1.27; 13.97,-1.27; 11.43,-1.27; 8.89,-1.27; 6.35,-1.27; 3.81,-1.27; 1.27,-1.27; -3.81,1.27; -3.81,-1.27; -6.35,1.27; -6.35,-1.27
FFC_24 = smd 0.3 x 0.8: P$1 -5.75,0; P$2 -5.25,0; P$3 -4.75,0; P$4 -4.25,0; P$5 -3.75,0; P$6 -3.25,0; P$7 -2.75,0; P$8 -2.25,0; P$9 -1.75,0; P$10 -1.25,0; P$11 -0.75,0; P$12 -0.25,0; P$13 0.25,0; P$14 0.75,0; P$15 1.25,0; P$16 1.75,0; P$17 2.25,0; P$18 2.75,0; P$19 3.25,0; P$20 3.75,0; P$21 4.25,0; P$22 4.75,0; P$23 5.25,0; P$24 5.75,0 | smd 0.85 x 1.4: P$25 1.175,-5.86; P$26 -1.175,-5.86 | smd 1.22 x 1.4: P$27 7,-4.85; P$28 -7,-4.85
SCREWTERMINAL-3.5MM-2 = drill 1.4 pad 2.3 square: 1 0,0 | drill 1.4 pad 2.3: 2 3.5,0
1X03 = drill 1.2 pad 2.2: 1 0,-0.1; 2 2.54,0.1; 3 5.08,-0.1
BNC = drill 2.2: 3 -5.08,5.08; 4 5.08,5.08 | drill 0.8 long: GND -2.54,0; S 0,0
PAD-JUMPER-2-NC_BY_TRACE_YES_SILK = smd 0.635 x 1.27: 1 -0.508,0; 2 0.508,0
SRP1265A = smd 5 x 5: P$1 -6.5,0; P$2 6.5,0
CHIP-LED0603 = smd 0.8 x 0.8: A 0,-0.75; C 0,0.75
SON5X6MM = smd 0.75 x 0.675: P$1 0,0; P$2 0,1.325; P$3 0,2.65; P$4 0,3.975 | smd 0.65 x 0.675: P$5 -5.55,3.975; P$6 -5.55,2.65; P$7 -5.55,1.325; P$8 -5.55,0 | smd 4.35 x 4.5: P$9 -3.05,1.988
SOT23-3 = smd 0.8 x 0.9: 1 -0.95,-1; 2 0.95,-1; 3 0,1.1
0603-RES = smd 1.1 x 1: 1 -0.85,0; 2 0.85,0
TACTILE_SWITCH_SMD_12MM = smd 1.6 x 1.55: 1 6.975,-2.5; 2 -6.975,-2.5; 3 6.975,2.5; 4 -6.975,2.5
SC70 = smd 0.4 x 0.75: 1 -0.65,-0.825; 2 0,-0.825; 3 0.65,-0.825; 4 0.65,0.825; 5 -0.65,0.825
SO08 = smd 0.6 x 1.2: 1 -1.905,-2.8; 2 -0.635,-2.8; 3 0.635,-2.8; 4 1.905,-2.8; 5 1.905,2.8; 6 0.635,2.8; 7 -0.635,2.8; 8 -1.905,2.8
SOT23-6 = smd 0.55 x 1.35: 1 -0.95,-1.375; 2 0,-1.375; 3 0.95,-1.375; 4 0.95,1.375; 5 0,1.375; 6 -0.95,1.375
TSSOP-16 = smd 0.4 x 1.1: 1 -2.275,-2.9; 2 -1.625,-2.9; 3 -0.975,-2.9; 4 -0.325,-2.9; 5 0.325,-2.9; 6 0.975,-2.9; 7 1.625,-2.9; 8 2.275,-2.9; 9 2.275,2.9; 10 1.625,2.9; 11 0.975,2.9; 12 0.325,2.9; 13 -0.325,2.9; 14 -0.975,2.9; 15 -1.625,2.9; 16 -2.275,2.9 | smd 3.6 x 3: P$1 0,0
SO8 = smd 0.6 x 2.2: 1 -1.905,-2.6; 2 -0.635,-2.6; 3 0.635,-2.6; 4 1.905,-2.6; 5 1.905,2.6; 6 0.635,2.6; 7 -0.635,2.6; 8 -1.905,2.6
MSOP10 = smd 0.3 x 1: 1 -1,-2.05; 2 -0.5,-2.05; 3 0,-2.05; 4 0.5,-2.05; 5 1,-2.05; 6 1,2.05; 7 0.5,2.05; 8 0,2.05; 9 -0.5,2.05; 10 -1,2.05
TSSOP-28_4MM = smd 1 x 0.3: 1 -3.2,4.225; 2 -3.2,3.575; 3 -3.2,2.925; 4 -3.2,2.275; 5 -3.2,1.625; 6 -3.2,0.975; 7 -3.2,0.325; 8 -3.2,-0.325; 9 -3.2,-0.975; 10 -3.2,-1.625; 11 -3.2,-2.275; 12 -3.2,-2.925; 13 -3.2,-3.575; 14 -3.2,-4.225; 15 3.2,-4.225; 16 3.2,-3.575; 17 3.2,-2.925; 18 3.2,-2.275; 19 3.2,-1.625; 20 3.2,-0.975; 21 3.2,-0.325; 22 3.2,0.325; 23 3.2,0.975; 24 3.2,1.625; 25 3.2,2.275; 26 3.2,2.925; 27 3.2,3.575; 28 3.2,4.225
TQFN20 = smd 0.95 x 0.35: P$1 -2.34,1.3; P$2 -2.34,0.65; P$3 -2.34,0; P$4 -2.34,-0.65; P$5 -2.34,-1.3; P$11 2.34,-1.3; P$12 2.34,-0.65; P$13 2.34,0; P$14 2.34,0.65; P$15 2.34,1.3 | smd 0.35 x 0.95: P$6 -1.3,-2.34; P$7 -0.65,-2.34; P$8 0,-2.34; P$9 0.65,-2.34; P$10 1.3,-2.34; P$16 1.3,2.34; P$17 0.65,2.34; P$18 0,2.34; P$19 -0.65,2.34; P$20 -1.3,2.34 | smd 3.25 x 3.25: P$21 0,0
EZOPH = drill 1.016 pad 1.905: GND -2.54,17.473; PGND 2.54,0.127; PRB 0,-0.127; RX 2.54,17.473; TX 0,17.727; VCC -2.54,0.127

### Placement (x,y rotation side)
C1  13.46,55.24 90 top
C2  22.61,63.25 90 top
C3  19.68,55.24 90 top
C4  39.62,59.69 270 top
C5  42.16,59.69 270 top
C6  32,59.69 180 bottom
C7  41.66,52.83 180 top
C8  41.66,48.77 180 top
C9  41.66,44.7 180 top
C10  27.43,56.13 180 top
C11  57.66,37.72 180 top
C12  25.4,12.7 180 bottom
C13  66.99,46.99 180 top
C14  80.64,46.99 180 top
C15  83.06,24.13 0 top
C16  103.5,20.95 270 top
C17  103.5,25.4 90 top
C18  114.94,25.4 90 top
C19  90.36,59.69 270 top
C20  103.5,10.16 90 top
C21  103.5,5.71 270 top
C22  114.94,10.16 90 top
C23  72.39,35.24 0 top
D1  68.83,61.98 0 top
D2  82.8,61.98 0 top
F1  14.61,63.37 270 top
F2  16.51,71.12 0 top
F3  38.48,66.55 270 top
FRAME1  -24.13,83.82 0 top  (outside the outline)
FRAME2  0,0 0 top
FRAME3  -56,0 0 top  (outside the outline)
FRAME4  -61.47,-69.09 0 top  (outside the outline)
J1  8.89,71.12 270 top
J2  17.27,29.03 0 top
J3  85.34,8.89 0 top
J4  71.12,67.31 180 top
J5  85.09,67.31 180 top
J6  120.65,21.59 90 top
J7  106.68,38.35 270 top
J8  120.65,6.35 90 top
JP1  33.02,12.7 0 bottom
L1  51.69,57.15 270 top
LED1  93.98,40.64 90 top
LED2  93.98,33.02 90 top
LED3  93.98,36.83 90 top
LED4  93.98,21.59 90 top
LED5  93.98,25.4 90 top
LED6  93.98,29.21 90 top
LED7  69.85,30.48 0 top
LED8  27.3,50.16 90 top
LED9  29.21,68.58 0 top
Q1  67.56,52.07 270 top
Q2  81.92,38.1 270 top
Q3  81.53,52.07 270 top
R1  12.7,47.62 90 top
R2  20.95,51.44 180 top
R3  20.95,48.9 180 top
R4  35.56,62.23 180 bottom
R5  32,62.23 180 bottom
R6  20.95,46.35 180 top
R7  31.5,53.59 0 top
R8  27.43,53.59 0 top
R9  31.5,56.13 180 top
R10  33.02,15.24 180 bottom
R11  33.02,20.32 180 bottom
R12  33.02,17.78 180 bottom
R13  73.66,31.11 180 top
R14  73.66,27.94 180 top
R15  66.99,49.85 0 top
R16  97.79,40.64 0 top
R17  97.79,33.02 0 top
R18  97.79,36.83 0 top
R19  97.79,20.32 0 top
R20  97.79,24.13 0 top
R21  97.79,29.21 0 top
R22  69.85,26.67 270 top
R23  30.8,50.16 0 top
R24  31.5,68.58 90 top
R25  80.64,49.85 0 top
R26  78.11,38.1 90 top
R27  63.75,54.86 90 top
R28  77.98,54.86 90 top
R29  108.92,19.05 0 top
R30  108.92,3.81 0 top
S1  116.84,66.8 0 top
U1  16.51,55.24 180 top
U2  6.35,45.09 90 top
U3  16.51,48.9 0 top
U4  33.53,59.69 90 top
U5  46.99,39.24 270 bottom
U6  25.4,17.78 90 bottom
U7  72.39,40.01 90 top
U8  82.89,30.13 180 top
U9  109.22,24.13 90 top
U10  98.93,50.29 0 top
U11  109.22,8.89 90 top

### Tracks (layer width: path | path; a pad name or v marks a point on that pad's centre or on a via)
3.3V  (via drill 0.25, 0.41, 0.61)
  Top 0.127: J3.P$1 79.59,7.84 79.38,7.62 | J3.P$3 80.59,8.2 80.01,7.62 79.38,7.62 | 79.38,7.62 78.74,7.62
  Top 0.254: 82.17,24.17 82.17,25.4 81.66,25.91 U8.28 | U11.P$20 104.11,7.59 103.5,6.99 C21.1 | U11.P$19 106.86,8.26 104.14,8.26 103.5,8.89 C20.1 | U9.P$20 106.85,22.86 104.14,22.86 103.5,22.23 C16.1 | C17.1 103.5,24.13 104.14,23.5 106.86,23.5 U9.P$19 | C15.1 v80.33,24.13 | R19.2 R20.2 98.64,26.25 v99.06,26.67 98.64,27.09 R21.2 R17.2 R18.2 R16.2 | U7.8 71.12,40.01 71.54,39.59 C23.1 70.48,35.24 v69.85,35.88 | R26.1 76.62,37.25 v76.2,36.83
  Top 0.406: 82.17,24.17 C15.1 | R22.2 69.85,24.13 | C21.1 102.02,6.57 101.6,6.99 101.6,9.53 | 101.6,9.53 101.6,10.16 100.97,10.79 v99.06,10.79 | C20.1 101.81,9.31 101.6,9.53 | C16.1 102.02,21.8 101.6,22.23 101.6,24.77 | 101.6,24.77 101.6,26.04 100.97,26.67 v99.06,26.67 | C17.1 101.81,24.55 101.6,24.77 | R13.2 72.07,31.11 71.44,30.48 71.44,27.3 | 71.44,27.3 71.44,24.13 | R14.2 72.07,27.94 71.44,27.3 | 78.74,7.62 77.47,7.62 76.52,8.57 | U10.VCC 91.5,50.42 90.65,51.28 90.49,51.44 90.36,51.56 C19.2
  Top 0.813: 76.52,8.57 v76.52,11.11
  Top 1.016: J2.1 59.18,24.64 59.69,24.13 69.85,24.13 71.44,24.13 v72.39,24.13 | J2.17 38.86,24.89 v38.1,24.13
  Route15 0.254: v69.85,35.88 69.85,36.2 70.17,36.51
  Bottom 0.254: 35.56,17.78 35.56,19.68 34.92,20.32 R11.2 | 35.56,17.78 v35.56,15.88 34.92,15.24 R10.2 | R12.2 35.56,17.78
  Bottom 0.406: U6.8 29.21,15.88 29.84,15.24 v29.84,12.7 C12.2
  pour Route15 (isolate 0.305): 100.33,54.61 101.6,53.34 101.6,8.89 100.33,7.62 30.48,7.62 29.21,8.89 29.21,36.83 30.48,38.1 90.17,38.1 91.44,39.37 91.44,50.8 91.44,53.34 92.71,54.61
5V  (via drill 0.41)
  Top 0.127: J3.P$5 81.59,7.62 80.96,6.99 | J3.P$7 82.59,7.66 81.92,6.99 | J3.P$9 83.59,7.71 82.87,6.99 | 82.87,6.99 81.92,6.99 | 81.92,6.99 80.96,6.99 | J3.P$11 84.59,7.64 83.93,6.99 82.87,6.99 | 80.96,6.99 78.11,6.99
  Top 0.254: R23.2 32.38,50.16 33.02,49.53
  Top 0.406: 78.11,6.99 76.52,6.99 75.25,8.26 | R7.2 33.02,52.92 33.02,49.53 33.02,42.23 33.97,41.27 41.59,41.27 42.86,42.55
  Top 0.813: v74.3,20.95 75.25,20 75.25,8.26
  Route15 0.813: v57.78,42.55 v51.44,42.55
  Bottom 0.254: U5.12 U5.13
  Bottom 0.813: v74.3,20.95 68.26,20.95 67.31,21.91 67.31,41.59 66.36,42.55 v57.78,42.55
  other vias: 45.4,44.13 46.35,43.18 47.31,44.13 49.21,44.13 51.12,44.13 50.16,43.18 48.26,43.18 47.31,42.23 45.4,42.23 44.45,43.18
  pour Top (isolate 0.254, rank 2): 43.18,56.64 42.16,55.63 42.16,42.99 43.29,41.91 54.3,41.91 55.44,43.36 55.44,55.63 54.42,56.64
  pour Bottom: 41.59,40.01 42.23,39.37 51.75,39.37 52.39,40.01 52.39,43.81 51.75,44.45 42.23,44.45 41.59,43.81
12V
  Top 0.406: R24.2 31.5,73.41
  Top 1.016: F3.1 38.48,73.66 | 85.09,72.39 J5.1 84.95,67.17 D2.C | 71.12,72.39 J4.1 70.98,67.17 D1.C | C2.+ 22.61,72.14
  Top 1.524: F2.2 21.59,71.12
  pour Top: 20.32,69.53 26.35,69.53 27.94,71.12 86.36,71.12 87,71.75 87,74.3 86.36,74.93 20.32,74.93 19.68,74.3 19.68,70.17
ADC_ALERT  (via drill 0.25, 0.41)
  Top 0.254: J2.29 23.62,26.23 24.13,25.72 24.89,26.35 24.89,34.42 25.24,34.77 25.72,35.24 49.53,35.24 50.32,36.04 50.32,40.48 51.12,41.27 64.77,41.27 v65.72,40.32 | LED1.C 88.9,40.64 86.36,38.1 Q2.3 v75.25,38.1
  Route15 0.254: v65.72,40.32 65.72,38.73 66.36,38.1 v75.25,38.1
GND  (via drill 0.25, 0.35, 0.41, 0.61)
  Top 0.254: U8.5 84.51,28.5 83.91,27.9 | 83.91,25.27 C15.2 85.6,24.13 86.36,23.37 v86.36,22.86 | 83.91,25.27 83.91,25.91 | 83.91,25.91 83.91,26.42 83.4,26.92 81.53,26.92 81.03,27.43 | U8.4 84.57,27.86 83.91,27.18 | U8.3 84.57,27.2 83.91,26.54 | U8.2 84.56,26.55 83.91,25.91 | U8.1 84.54,25.91 83.91,25.27 | 81.03,27.94 81.03,28.57 80.57,29.16 U8.23 | 81.03,27.94 81.03,27.43 | 81.03,27.94 80.59,28.5 U8.24 | 81.03,27.43 80.6,27.86 U8.25 | C21.2 104.56,4.87 v104.78,5.08 | C20.2 104.56,11.01 v104.78,10.79 | v113.03,11.43 113.03,10.79 112.42,10.19 U11.P$10 111.53,10.16 110.49,10.16 U11.P$21 107.92,10.19 | v113.03,26.67 113.03,26.04 112.39,25.4 112.36,25.43 U9.P$10 111.53,25.4 110.17,25.4 109.22,24.45 U9.P$21 | 107.92,10.19 U11.P$15 107.92,11.46 107.31,12.06 v106.05,12.06 106.05,10.79 106.65,10.19 U11.P$16 107.92,10.19 | C16.2 104.56,20.11 v104.78,20.32 | C17.2 104.56,26.25 v104.78,26.04 | v66.67,45.4 66.14,45.94 C13.2 | C14.2 79.8,45.94 v80.33,45.4 | U7.3 73.66,40.01 73.34,39.69 73.34,38.42 | U7.1 73.93,39.01 73.34,38.42 | 73.34,38.42 73.34,35.34 C23.2 74.61,35.24 v74.93,35.56 | Q2.2 80.92,36.47 v80.33,35.88 | LED8.C v25.08,50.16 | R9.1 34.04,56.13 34.29,55.88 | U9.P$15 107.92,25.43 U9.P$16 106.65,25.43 106.05,26.04 v106.05,27.3 107.31,27.3 107.92,26.7 U9.P$15
  Top 0.305: 83.91,26.42 83.91,26.54 83.91,27.18 83.91,27.9 83.91,33.87 84.39,34.35 U8.14
  Top 0.406: C1.2 13.46,57.28 v13.97,57.78 16.51,57.78 | R3.1 21.8,47.62 | 21.8,47.62 R6.1 | v22.86,47.62 21.8,47.62 | U3.2 v16.51,45.72 | LED9.C 27.42,69.33 v27.3,69.22 | LED7.C v69.85,32.38 | v94.61,60.33 93.85,61.09 C19.1 90.36,66.55 91.58,67.77 U10.GND | J2.30 23.62,33.85 v23.18,34.29 | J2.34 18.54,33.85 v18.1,34.29 | J2.39 10.92,24.32 v11.43,23.81 | J2.25 28.7,24.32 v29.21,23.81 | J2.20 36.32,33.53 v35.56,34.29 | J2.14 43.94,33.53 v43.18,34.29 | J2.9 49.02,24.96 v49.53,24.45 | C3.2 19.68,57.15 19.05,57.78 16.51,57.78 | U1.2 16.51,57.78 | U2.4 10.16,46.99 10.79,47.62 v10.79,48.58
  Top 1.016: v76.83,58.74 76.83,57.41 R28.2 | R27.2 62.55,57.47 v62.55,58.74 | C2.- 22.61,56.77 v23.5,55.88 | C11.- 60.71,37.72 v61.59,36.83 | J2.6 54.1,36.7 v53.34,37.47
  Route2 0.254: v104.78,5.08 105.41,5.08 105.41,5.71 | v104.78,10.79 104.78,10.16 | v104.78,20.32 104.78,20.95 | v104.78,26.04 104.78,25.4 | v35.56,12.7 35.56,13.34 | v20.32,14.61 20.95,14.61 | v86.36,22.86 85.72,22.86 | v66.67,45.4 67.63,45.4 | v80.33,35.88 79.38,35.88 | v74.93,35.56 76.2,35.56 | v25.08,50.16 25.08,50.8
  Route2 0.305: 86.11,24.64 86.11,25.15
  Route2 0.406: v13.97,57.78 13.97,58.42 | v16.51,45.72 17.78,45.72 | v27.3,69.22 26.67,68.58 27.3,68.58 | v69.85,32.38 69.85,33.02 70.48,33.02 71.12,32.38 | v94.61,60.33 95.25,60.96 | v10.79,48.58 10.16,48.58
  Route2 1.016: v23.5,55.88 23.5,57.15 | v61.59,36.83 61.59,35.56 | v53.34,37.47 53.34,38.1
  Bottom 0.254: R5.1 30.48,62.23 v29.97,61.72 | JP1.1 v35.56,12.7
  Bottom 0.406: U6.4 20.95,19.68 20.32,19.05 20.32,17.78 | 20.32,17.78 20.32,16.51 | 20.32,16.51 20.32,15.24 | 20.32,15.24 v20.32,14.61 23.5,14.61 24.55,13.55 C12.1 | U6.3 20.95,18.41 20.32,17.78 | U6.2 20.95,17.14 20.32,16.51 | U6.1 20.95,15.88 20.32,15.24 | U5.8 51.93,36.97 v52.7,36.2
  other vias: 40.64,55.12 39.62,56.13 38.61,55.12 36.58,55.12 37.59,56.13 38.61,57.15 40.64,57.15 36.58,57.15 35.56,56.13 34.54,55.12 34.54,57.15 86.04,6.99 87.95,6.99 89.85,6.99 91.76,6.99
  pour Top: 43.18,54.61 34.04,54.61 33.53,55.12 33.53,58.93 34.04,59.44 43.18,59.44 43.69,58.93 43.69,55.12
  pour Top: 34.54,59.18 33.53,58.17 33.53,42.67 34.29,41.91 40.43,41.91 41.15,42.99 41.15,58.17 40.13,59.18
  pour Route2: 0,76.2 127,76.2 127,0 0,0
  pour Top: 76.2,10.16 93.98,10.16 93.98,1.27 76.2,1.27
  pour Route15 (isolate 0.305, rank 2): 0,76.2 127,76.2 127,0 0,0
GP1  (via drill 0.25)
  Top 0.254: J2.7 51.56,24.96 v52.07,24.45 | J3.P$23 90.59,17.99 v89.53,19.05
  Bottom 0.254: v52.07,24.45 52.07,17.78 52.77,17.08 74.55,17.08 76.52,19.05 v89.53,19.05
GP2  (via drill 0.25)
  Top 0.254: J2.11 46.48,24 46.99,23.5 v47.94,23.5 | J3.P$19 88.59,16.82 v87.63,17.78
  Bottom 0.254: v47.94,23.5 47.94,16.83 48.45,16.32 75.69,16.32 77.15,17.78 v87.63,17.78
GP3  (via drill 0.25)
  Top 0.254: J2.12 46.99,32.07 47.75,31.43 47.75,24.64 48.26,24.13 v48.58,24.13 | J3.P$21 89.59,17.4 v88.58,18.41
  Bottom 0.254: v48.58,24.13 48.58,17.14 49.02,16.7 75.12,16.7 76.83,18.41 v88.58,18.41
GP5  (via drill 0.25)
  Top 0.254: J2.15 41.4,22.42 42.23,21.59 v46.04,21.59 | J3.P$13 85.59,15.05 v84.77,15.88
  Bottom 0.254: v46.04,21.59 46.04,15.88 46.8,15.11 77.34,15.11 78.11,15.88 v84.77,15.88
GP6  (via drill 0.25)
  Top 0.254: J2.16 41.88,32.04 42.67,31.38 42.67,25.4 42.67,22.73 43.18,22.23 v46.67,22.23 | J3.P$15 86.59,15.64 v85.72,16.51
  Bottom 0.254: v46.67,22.23 46.67,16.19 47.31,15.56 76.83,15.56 77.79,16.51 v85.72,16.51
GP7  (via drill 0.25)
  Top 0.254: J2.18 39.37,32.07 | 39.37,32.07 39.37,32.38 39.37,32.07 | 39.37,32.07 40.13,31.3 40.13,21.78 40.96,20.95 v45.4,20.95 | J3.P$12 85.09,14.28 v84.14,15.24
  Bottom 0.254: v45.4,20.95 45.4,15.56 46.23,14.73 77.92,14.73 78.42,15.24 v84.14,15.24
GP9  (via drill 0.25)
  Top 0.254: J2.13 43.94,23.37 44.45,22.86 v47.31,22.86 | J3.P$17 87.59,16.23 v86.68,17.14
  Bottom 0.254: v47.31,22.86 47.31,16.51 47.88,15.94 76.26,15.94 77.47,17.14 v86.68,17.14
ID_SC  (via drill 0.25)
  Top 0.254: J2.28 26.16,33.53 v26.04,33.66
  Bottom 0.254: R12.1 30.9,17.78 30.27,18.41 U6.6 26.04,18.41 24.89,19.56 24.89,32.51 v26.04,33.66
ID_SD  (via drill 0.25)
  Top 0.254: J2.27 26.16,24.64 v26.67,24.13
  Bottom 0.254: R11.1 30.48,20.32 29.84,19.68 U6.5 26.67,19.68 26.04,20.32 26.04,23.5 v26.67,24.13
LED0
  Top 0.254: U8.9 90.8,31.11 92.71,33.02 LED2.C
LED1
  Top 0.254: U8.10 89.54,31.75 90.81,33.02 90.81,35.88 91.76,36.83 LED3.C
MISO  (via drill 0.25)
  Top 0.254: U11.P$14 108.57,12.08 v107.95,12.7 v101.6,12.7 | U9.P$14 108.57,27.32 v107.95,27.94 | J2.21 33.78,20.83 34.92,19.68 v41.91,19.68 | J3.P$8 83.09,13.43 v82.55,13.97
  Bottom 0.254: v107.95,27.94 v107.95,12.7 | v101.6,12.7 100.33,12.7 97.79,15.24 95.25,15.24 93.98,13.97 85.09,13.97 v82.55,13.97 45.34,13.97 44.39,14.92 44.39,18.8 43.5,19.68 v41.91,19.68
MOE2
  Top 0.254: U9.P$5 110.52,20.93 111.12,20.32 111.76,20.32 112.39,20.95 112.39,22.23 113,22.83 | 113,22.83 U9.P$6 | 113,22.83 116.23,22.83 117.47,21.59 J6.1
MOE3
  Top 0.254: 113.03,7.59 116.23,7.59 117.47,6.35 J8.1 | 113.03,7.59 U11.P$6 | U11.P$5 110.52,5.68 111.12,5.08 111.76,5.08 112.39,5.71 112.39,6.96 113.03,7.59
MOSI  (via drill 0.25)
  Top 0.254: U11.P$11 110.52,13.94 v109.86,14.61 v101.6,14.61 | U9.P$11 110.52,29.18 v109.86,29.84 | J2.19 36.32,21.14 37.15,20.32 v41.91,20.32 | J3.P$10 84.09,14.01 83.82,14.29 v83.5,14.61
  Bottom 0.254: v109.86,29.84 v109.86,14.61 | v101.6,14.61 101.28,14.61 100.01,15.88 95.25,15.88 93.73,14.35 85.09,14.35 84.39,14.35 84.14,14.61 v83.5,14.61 78.74,14.61 78.49,14.35 45.66,14.35 44.77,15.24 44.77,19.37 43.81,20.32 v41.91,20.32
N$1
  Top 0.406: U2.3 11.64,45.72 R1.1
N$2
  Top 0.254: R16.1 LED1.A
N$3
  Bottom 0.254: U6.7 29.84,17.14 30.48,16.51 30.48,15.24 | 30.48,15.24 30.48,13.34 31.11,12.7 JP1.2 | R10.1 30.48,15.24
N$4  (via drill 0.41)
  Top 0.406: U4.6 29.65,58.74 v29.46,58.93
  Bottom 0.406: C6.1 30.23,59.69 29.84,59.31 v29.46,58.93
N$5  (via drill 0.41, 0.61)
  Top 0.508: U4.2 v36.83,59.69
  Top 1.016: v36.83,59.69 v37.85,59.69 | L1.P$1 51.69,60.58 50.8,59.69 v48.58,59.69 v46.99,59.69
  Bottom 0.406: C6.2 v36.83,59.69
  Bottom 1.016: v36.83,59.69 v37.85,59.69 v46.99,59.69 48.9,59.69
N$6  (via drill 0.41)
  Top 1.016: J2.4 56.64,34.16 v55.88,34.92 | J2.2 59.18,34.16 58.42,34.92 v55.88,34.92 | C11.+ 56.26,35.3 v55.88,34.92
  Bottom 1.016: v55.88,34.92 51.75,34.92
  pour Bottom: 42.55,38.73 51.44,38.73 52.07,38.1 52.07,34.29 51.44,33.66 42.55,33.66 41.91,34.29 41.91,38.1
N$7
  Top 0.406: R7.1 R8.2 C10.1
N$8
  Top 0.406: R8.1 C10.2 26.58,57.32 26.92,57.66 28.45,57.66 | U4.4 29.4,60.64 28.45,59.69 28.45,57.66 | R9.2 30.65,57.24 30.23,57.66 28.45,57.66
N$9  (via drill 0.25)
  Top 0.254: U4.5 33.02,59.69 33.27,59.94 33.27,61.72 v33.78,62.23
  Bottom 0.254: R4.1 v33.78,62.23 R5.2
N$11
  Top 0.254: J7.S 104.52,40.51 102.78,40.51 101.09,42.2 101.09,47.94 98.93,50.1 U10.PRB
N$12
  Top 0.254: J7.GND 102.93,40.89 101.47,42.35 U10.PGND
N$13
  Top 1.016: J4.2 66.68,66.37 D1.A 66.68,58.5 Q1.P$8 68.58,57.62 | 68.58,57.62 69.85,57.62 | 69.85,57.62 Q1.P$5 | Q1.P$9 69.85,55.42 69.85,57.62 | Q1.P$6 68.58,57.62 | Q1.P$7 68.58,57.62
N$14
  Top 1.016: J5.2 80.65,66.37 D2.A 80.65,58.75 Q3.P$8 Q3.P$5 | Q3.P$9 83.82,55.67 84.18,56.04 Q3.P$6 Q3.P$5 | Q3.P$7 Q3.P$5
N$15
  Top 0.254: C13.1 67.84,48.26 | 67.84,48.26 R15.2 | 67.84,48.26 72.39,48.26 73.34,47.31 73.34,40.96 73.66,40.64 73.8,40.51 U7.4
N$16
  Top 0.254: Q2.1 78.2,39.05 R26.2 78,39.05 76.83,39.05 76.38,39.51 U7.2
N$17
  Top 0.254: R17.1 96.88,33.02 LED2.A
N$18
  Top 0.254: R18.1 96.88,36.83 LED3.A
N$19
  Top 0.254: LED4.A 96,20.32 R19.1
N$20
  Top 0.254: LED5.A 96,24.13 R20.1
N$21
  Top 0.254: R21.1 96.88,29.21 LED6.A
N$22
  Top 0.406: R22.1 LED7.A
N$23
  Top 0.254: LED8.A R23.1
N$24
  Top 0.406: R24.1 29.31,67.73 LED9.A
N$25
  Top 0.254: R25.2 81.5,48.26 | 81.5,48.26 C14.1 | U7.5 75.3,41.01 76.2,41.91 76.2,47.31 77.15,48.26 81.5,48.26
N$26
  Top 0.406: U2.5 3.68,47.12 2.54,48.26 2.54,52.7 3.46,53.62 J1.6
N$27
  Top 0.406: J1.5 2.51,57.12 1.27,55.88 1.27,46.99 2.54,45.72 U2.6
N$29
  Top 0.254: U9.P$1 U9.P$2 108.57,20.34 108.06,19.83 R29.1
N$30
  Top 0.254: U9.P$4 U9.P$3 109.22,20.32 109.77,19.77 R29.2
N$31
  Top 0.254: J6.3 116.84,26.67 116.42,26.25 C18.2 113.88,26.25 113.67,26.04 113.67,24.77 | U9.P$8 113.03,24.13 113.67,24.77 | U9.P$9 113.65,24.78 113.67,24.77
N$32
  Top 0.254: J6.2 116.84,24.13 116.42,24.55 C18.1 114.08,24.55 113.03,23.5 111.58,23.5 U9.P$7
N$33
  Top 0.254: U11.P$1 U11.P$2 108.57,5.07 108.06,4.56 R30.1
N$34
  Top 0.254: U11.P$4 U11.P$3 109.22,5.08 109.77,4.54 R30.2
N$35
  Top 0.254: J8.3 116.84,11.43 116.42,11.01 C22.2 113.88,11.01 113.67,10.79 113.67,9.53 | U11.P$8 113.03,8.89 113.67,9.53 | U11.P$9 111.58,9.53 113.67,9.53
N$36
  Top 0.254: J8.2 116.84,8.89 116.42,9.31 C22.1 114.08,9.31 113.35,8.57 113.02,8.24 U11.P$7
N$37
  Top 0.406: U3.6 13.44,50.27 12.7,49.53 R1.2
N$38
  Top 0.406: R3.2 20.11,50.16 | 20.11,50.16 R2.2 | 20.11,50.16 20,50.27 U3.4
N$39
  Top 0.406: U3.3 17.46,46.67 17.78,46.35 R6.2
N$40  (via drill 0.35, 0.41)
  Top 0.406: 17.78,53.34 17.16,53.96 U1.5 | 17.78,53.34 19.05,53.34 | 19.05,53.34 19.68,53.98 C3.1 | U3.5 16.51,51.44 17.78,52.7 | 17.78,52.7 17.78,53.34 | R2.1 21.8,52.49 20.95,53.34 19.05,53.34 | S1.1 121.92,66.2 121.92,73.03 v120.65,74.3 | v18.41,52.07 17.78,52.7
  Bottom 0.406: v120.65,74.3 21.59,74.3 18.41,74.3 17.78,73.66 17.78,52.7 v18.41,52.07
N$41
  Top 0.406: U1.4 15.86,53.96 15.24,53.34 13.97,53.34 13.46,53.85 C1.1 12.33,54.34 11.43,55.24 11.43,59.69 12.57,60.83 F1.P$2
N$42
  Top 1.016: J1.3 12.81,64.12 F1.P$1
N$43  (via drill 0.25)
  Bottom 0.254: R4.2 37.08,62.23 v37.59,61.72
  pour Top: 43.18,59.94 34.04,59.94 33.53,60.45 33.53,65.53 34.04,66.04 43.18,66.04 43.69,65.53 43.69,60.45
N$44
  Top 1.524: J1.1 F2.1
P1ISENSE
  Top 0.406: Q1.P$1 68.58,52.07 Q1.P$2
  Top 1.016: R27.1 65.15,52.07 | 65.15,52.07 68.58,52.07 Q1.P$3 | R15.1 65.15,50.84 65.15,52.07
P1PWM  (via drill 0.41)
  Top 0.254: U8.16 77.74,33.7 v77.15,34.29 | Q1.P$4 71.54,50.38 v72.39,49.53
  Bottom 0.254: v77.15,34.29 73.66,34.29 72.39,35.56 v72.39,49.53
P2ISENSE
  Top 1.016: Q3.P$3 81.92,52.07 | 81.92,52.07 79.37,52.07 | 79.37,52.07 R28.1 | R25.1 79.37,50.27 79.37,52.07 | Q3.P$1 81.92,52.07 | Q3.P$2 81.92,52.07
P2PWM  (via drill 0.41)
  Top 0.254: Q3.P$4 85.51,48.48 v86.68,47.31 | U8.15 78.67,34.35 v77.79,35.24
  Bottom 0.254: v86.68,47.31 86.68,36.2 85.72,35.24 v77.79,35.24
PHGOOD
  Top 0.254: U8.8 90.83,30.45 92.08,29.21 LED6.C
PON  (via drill 0.25, 0.35, 0.41)
  Top 0.254: J2.33 18.54,24.89 v17.78,24.13
  Top 0.406: S1.3 123.81,73.67 v122.56,74.93 | U3.1 15.56,46.04 v15.24,45.72
  Bottom 0.254: v15.24,45.72 17.27,43.69 17.27,24.64 | 17.27,24.64 v17.78,24.13 17.27,24.64
  Bottom 0.406: v15.24,45.72 15.24,46.99 16.51,48.26 16.51,73.66 17.78,74.93 v122.56,74.93
RDY0  (via drill 0.25)
  Top 0.254: U9.P$18 106.05,24.13 v105.41,24.77 | J2.31 21.08,17.65 22.23,16.51 v41.91,16.51 | v105.41,15.88 101.6,15.88 97.16,15.88 96.2,14.92 v96.2,12.06
  Bottom 0.254: v105.41,15.88 v105.41,24.77 | v96.2,12.06 85.09,12.06 83.5,10.48 79.69,10.48 78.11,12.06 44.13,12.06 42.86,13.34 42.48,13.72 42.48,15.94 v41.91,16.51
RDY1  (via drill 0.25)
  Top 0.254: U11.P$18 106.05,8.89 105.41,9.53 105.41,11.43 104.78,12.06 v101.6,12.06 | 21.27,32.38 22.35,31.43 22.35,18.29 23.5,17.14 v41.91,17.14
  Top 0.406: J2.32 21.27,31.75 21.27,32.38
  Bottom 0.254: v101.6,12.06 100.01,12.06 99.38,12.7 95.25,12.7 95,12.45 84.84,12.45 83.5,11.11 79.69,11.11 78.36,12.45 44.39,12.45 42.86,13.97 42.86,16.51 42.23,17.14 v41.91,17.14
RX  (via drill 0.25)
  Top 0.254: J2.8 51.56,37.59 v52.7,38.73 | v98.23,73.66 99.47,72.42 99.47,69.85 101.47,67.84
  Top 0.406: 101.47,67.84 U10.RX
  Bottom 0.254: v52.7,38.73 52.7,72.71 53.66,73.66 v98.23,73.66
SCL  (via drill 0.25)  (1 unrouted)
  Top 0.254: J2.5 54.1,23.05 55.24,21.91 73.66,21.91 74.51,22.76 R14.1 | J3.P$4 81.09,20.82 80.33,21.59 77.47,21.59 76.83,22.23 v76.83,25.4 76.83,26.67 | U8.26 77.37,27.2 76.83,26.67 | U7.10 69.48,39.01 68.9,38.42 68.9,34.61 69.53,33.97 75.56,33.97 76.26,33.27 76.26,27.24 76.83,26.67
  Route15 0.254: v76.83,25.4 v74.51,25.4
SCLK  (via drill 0.25)
  Top 0.254: U11.P$12 109.87,13.32 v109.22,13.97 107.95,13.97 102.87,13.97 v97.47,13.97 | U9.P$12 109.87,28.56 v109.22,29.21 | J2.23 31.24,19.56 32.38,18.41 v41.91,18.41 | J3.P$6 82.09,12.2 v81.92,12.38
  Bottom 0.254: v109.22,13.97 v109.22,29.21 | v97.47,13.97 95.25,13.97 94.49,13.21 85.09,13.21 84.33,13.21 83.5,12.38 v81.92,12.38 79.69,12.38 78.87,13.21 44.9,13.21 43.62,14.48 43.62,17.65 42.86,18.41 v41.91,18.41
SDA  (via drill 0.25)
  Top 0.254: J2.3 56.64,23.69 57.78,22.54 72.39,22.54 73.66,23.81 73.66,29.53 74.51,30.38 R13.1 75.25,31.11 75.88,30.48 75.88,30.16 | J3.P$2 80.09,19.92 79.38,20.64 77.15,20.64 75.88,21.91 v75.88,26.04 | v75.88,26.04 75.88,26.99 | 75.88,26.99 75.88,30.16 | U8.27 78.31,26.55 v77.79,26.04 | v75.88,26.04 75.88,26.99 | U7.9 69.45,39.51 68.52,38.58 68.52,34.45 69.38,33.59 75.31,33.59 75.88,33.02 75.88,30.16
  Route15 0.254: v77.79,26.04 v75.88,26.04
SS0  (via drill 0.25)
  Top 0.254: U9.P$13 109.22,27.94 v108.58,28.57 | 31.43,32.38 32.51,31.43 32.51,20.19 33.66,19.05 v41.91,19.05 | v97.47,14.61 98.11,15.24 v108.58,15.24
  Top 0.406: J2.24 31.43,31.75 31.43,32.38
  Bottom 0.254: v108.58,28.57 v108.58,15.24 | v97.47,14.61 95.25,14.61 94.23,13.59 85.09,13.59 84.07,13.59 83.82,13.34 79.38,13.34 79.12,13.59 45.15,13.59 44.01,14.73 44.01,18.22 43.18,19.05 v41.91,19.05
SS1  (via drill 0.25)
  Top 0.254: U11.P$13 109.22,12.7 108.58,13.34 107.95,13.34 102.87,13.34 v97.47,13.34 | 28.89,32.38 29.97,31.43 29.97,18.92 31.11,17.78 v41.91,17.78
  Top 0.406: J2.26 28.89,31.75 28.89,32.38
  Bottom 0.254: v97.47,13.34 95.25,13.34 94.74,12.83 85.09,12.83 84.58,12.83 83.5,11.75 79.69,11.75 78.61,12.83 44.64,12.83 43.24,14.22 43.24,17.08 42.55,17.78 v41.91,17.78
T1GOOD
  Top 0.254: U8.6 88.64,29.16 89.53,28.26 89.53,22.54 90.49,21.59 LED4.C
T2GOOD
  Top 0.254: U8.7 89.58,29.8 90.81,28.57 90.81,26.35 91.76,25.4 LED5.C
TX  (via drill 0.25)
  Top 0.254: J2.10 51.03,33.57 51.03,38.1 53.34,40.41 | U10.TX 98.93,71.88 v97.69,73.13
  Top 0.406: v53.34,40.64 53.34,40.41
  Bottom 0.254: v53.34,40.64 53.34,72.07 54.29,73.03 54.39,73.13 v97.69,73.13

### Text on the board
tPlace: rPi Zero W / Face Down
tNames: PUMP1 | PUMP2 | 12v PG | POWER | POWER IN | 5v PG | PH | PUMP ALERT | Brew Controller - Rev A / 9/2018 | LED1 | 3.3v PG | LED0 | PH GOOD | TEMP2 | T1 GOOD | T2 GOOD | TEMP1 | EXP